# EAGLE design teensyMotors (EAGLE 9.1.3)
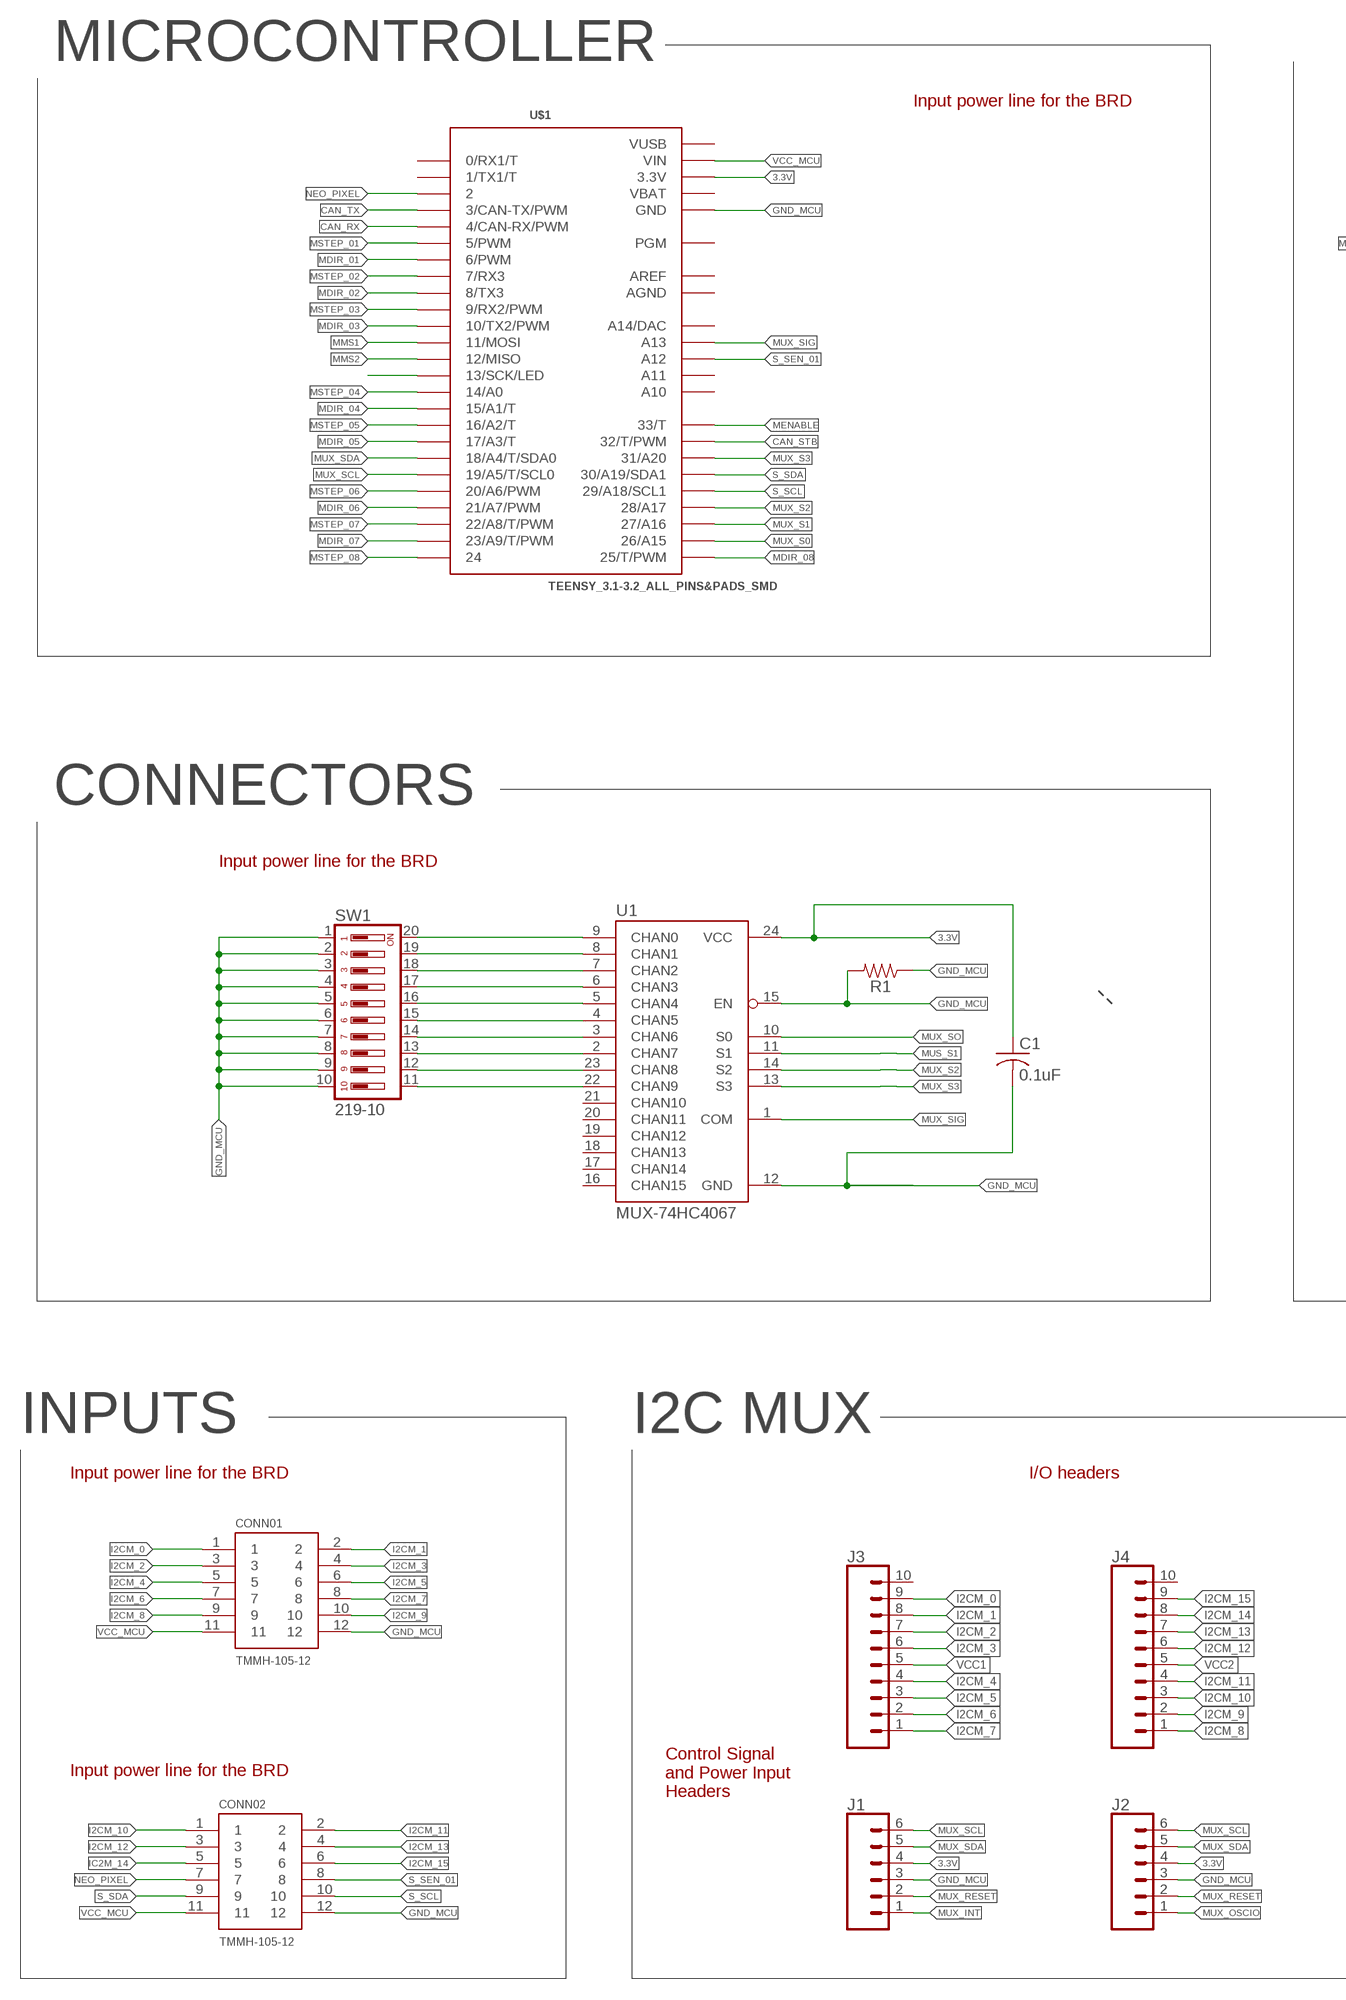
[diagram p0: schematic, sheet 1, part 1 of 2]
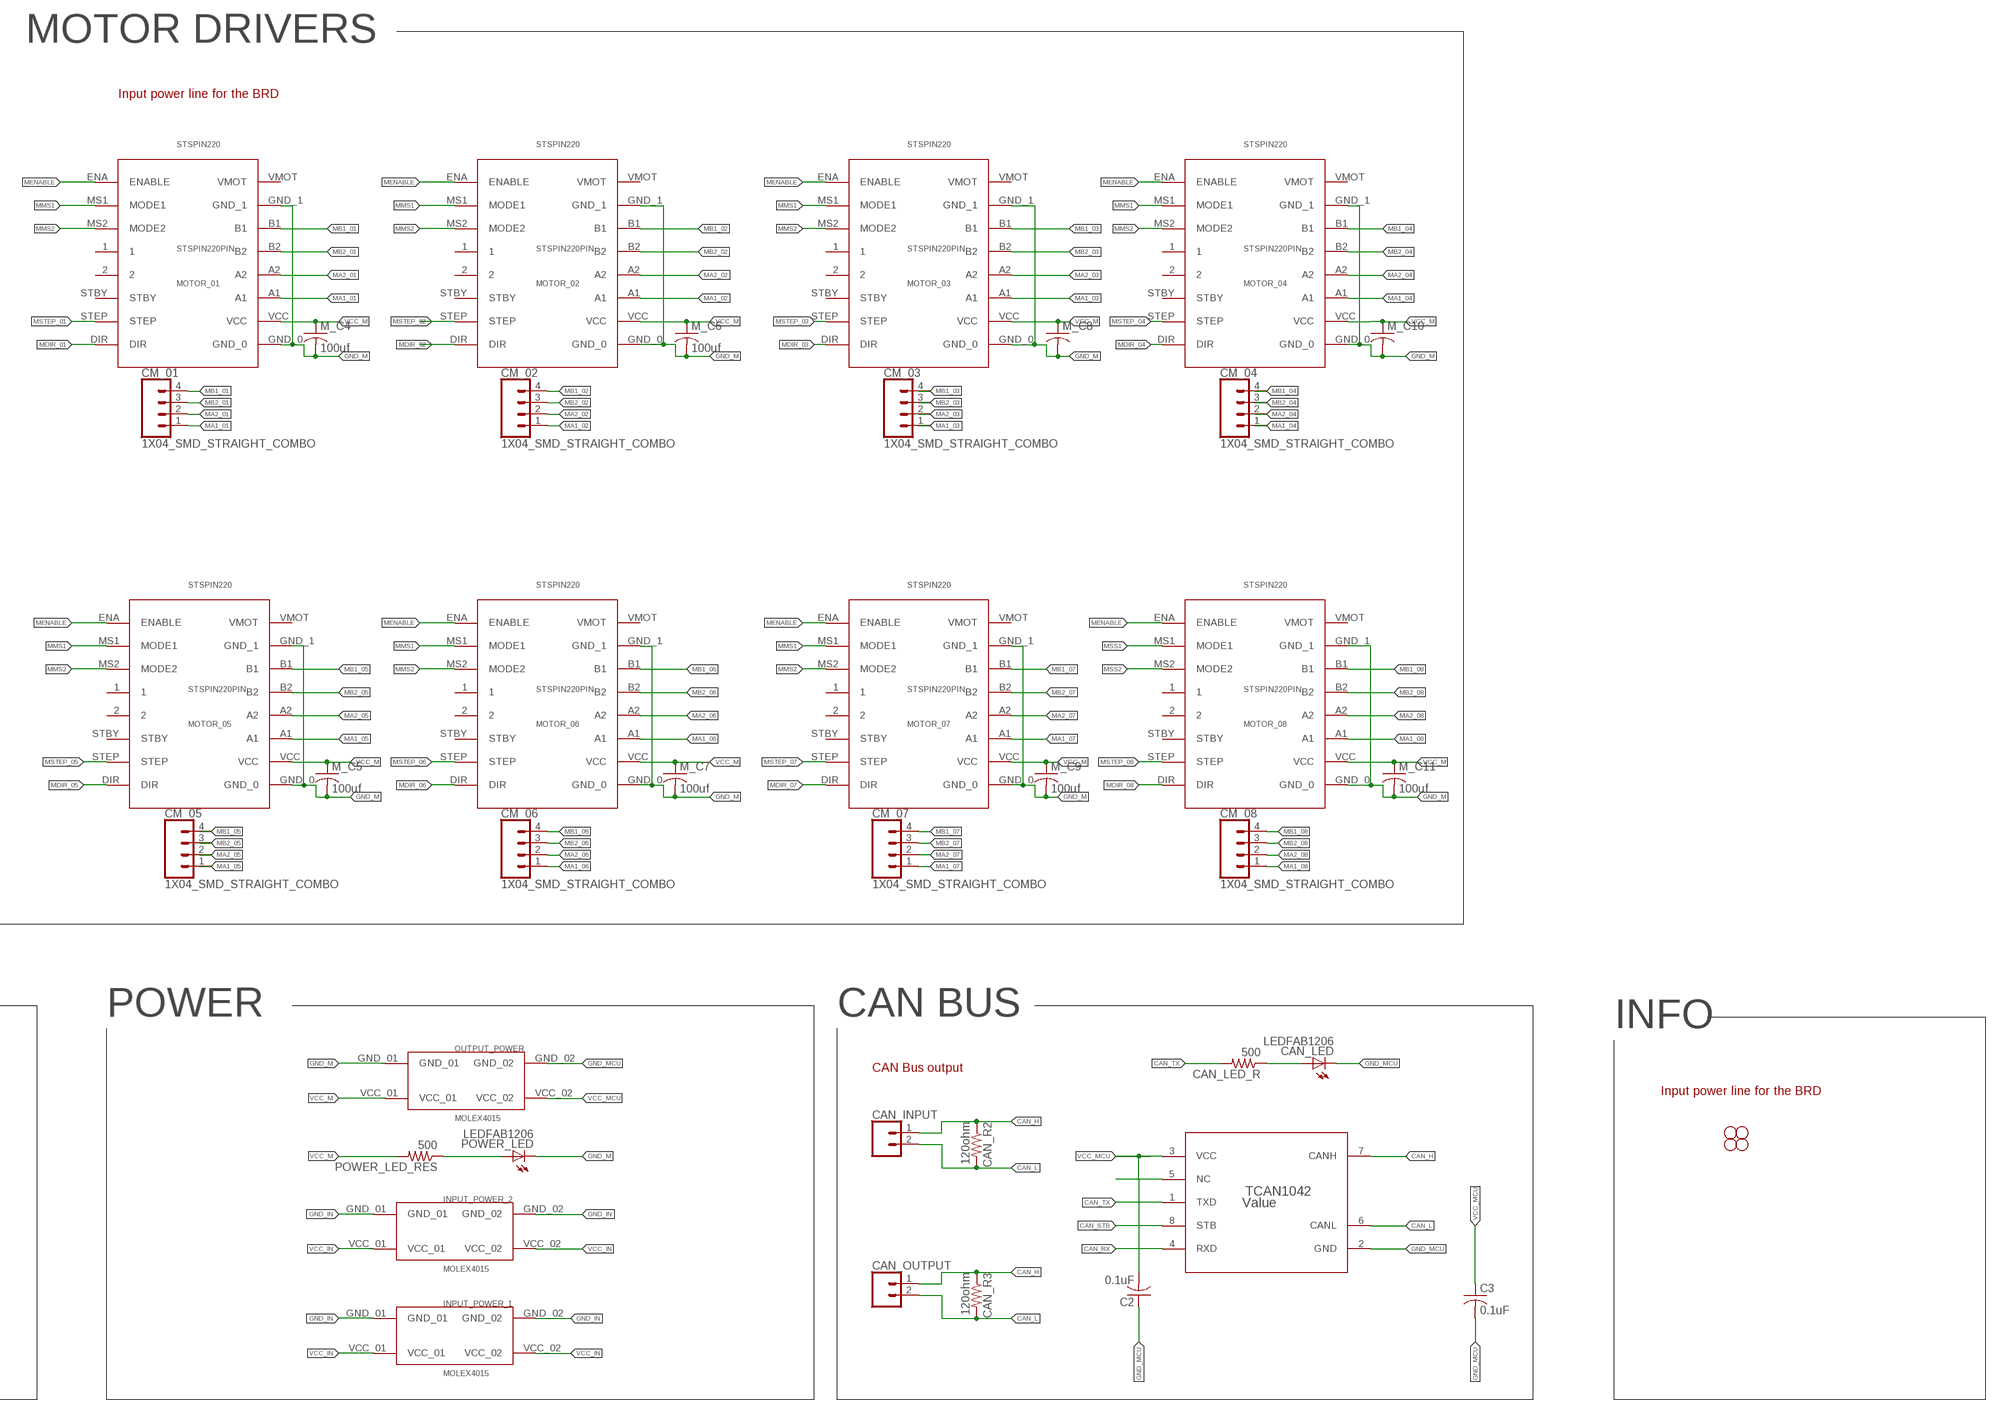
[diagram p1: schematic, sheet 1, part 2 of 2]

## Parts
C1  0.1uF  C-USC1206  [C1206]
C2  0.1uF  C-USC1206  [C1206]
C3  0.1uF  C-USC1206  [C1206]
CAN_INPUT  CONN_02-JST-2MM-SMT  [JST-2-SMD]
CAN_LED  LEDFAB1206  [LED1206FAB]
CAN_LED_R  500  RES-US1206FAB  [R1206FAB]
CAN_OUTPUT  CONN_02-JST-2MM-SMT  [JST-2-SMD]
CAN_R2  120ohm  RESISTOR1206  [1206]
CAN_R3  120ohm  RESISTOR1206  [1206]
CM_01  1X04_SMD_STRAIGHT_COMBO  CONN_04SMD_STRAIGHT_COMBO  [1X04_SMD_VERTICAL_COMBO]
CM_02  1X04_SMD_STRAIGHT_COMBO  CONN_04SMD_STRAIGHT_COMBO  [1X04_SMD_VERTICAL_COMBO]
CM_03  1X04_SMD_STRAIGHT_COMBO  CONN_04SMD_STRAIGHT_COMBO  [1X04_SMD_VERTICAL_COMBO]
CM_04  1X04_SMD_STRAIGHT_COMBO  CONN_04SMD_STRAIGHT_COMBO  [1X04_SMD_VERTICAL_COMBO]
CM_05  1X04_SMD_STRAIGHT_COMBO  CONN_04SMD_STRAIGHT_COMBO  [1X04_SMD_VERTICAL_COMBO]
CM_06  1X04_SMD_STRAIGHT_COMBO  CONN_04SMD_STRAIGHT_COMBO  [1X04_SMD_VERTICAL_COMBO]
CM_07  1X04_SMD_STRAIGHT_COMBO  CONN_04SMD_STRAIGHT_COMBO  [1X04_SMD_VERTICAL_COMBO]
CM_08  1X04_SMD_STRAIGHT_COMBO  CONN_04SMD_STRAIGHT_COMBO  [1X04_SMD_VERTICAL_COMBO]
CONN01  TMMH-105-12  [TMMH-105-12]
CONN02  TMMH-105-12  [TMMH-105-12]
INPUT_POWER_1  MOLEX4015  [MOLEX4015]
INPUT_POWER_2  MOLEX4015  [MOLEX4015]
J1  CONN_06SMD_MALE  [1X06_SMD_MALE]
J2  CONN_06SMD_MALE  [1X06_SMD_MALE]
J3  CONN_10SMD_MALE  [1X10_SMD_MALE]
J4  CONN_10SMD_MALE  [1X10_SMD_MALE]
M_C4  100uf  C-USC1206  [C1206]
M_C5  100uf  C-USC1206  [C1206]
M_C6  100uf  C-USC1206  [C1206]
M_C7  100uf  C-USC1206  [C1206]
M_C8  C-USC1206  [C1206]
M_C9  100uf  C-USC1206  [C1206]
M_C10  C-USC1206  [C1206]
M_C11  100uf  C-USC1206  [C1206]
MOTOR_01  STSPIN220PIN  [STSPIN220]
MOTOR_02  STSPIN220PIN  [STSPIN220]
MOTOR_03  STSPIN220PIN  [STSPIN220]
MOTOR_04  STSPIN220PIN  [STSPIN220]
MOTOR_05  STSPIN220PIN  [STSPIN220]
MOTOR_06  STSPIN220PIN  [STSPIN220]
MOTOR_07  STSPIN220PIN  [STSPIN220]
MOTOR_08  STSPIN220PIN  [STSPIN220]
OUTPUT_POWER  MOLEX4015  [MOLEX4015]
POWER_LED  LEDFAB1206  [LED1206FAB]
POWER_LED_RES  500  RES-US1206FAB  [R1206FAB]
R1  RESISTOR1206  [1206]
STANDOFF5  STAND-OFF  [STAND-OFF]
STANDOFF6  STAND-OFF  [STAND-OFF]
STANDOFF7  STAND-OFF  [STAND-OFF]
STANDOFF8  STAND-OFF  [STAND-OFF]
SW1  219-10  [CTS-219-10]
TCAN1042  Value  TCAN1042DRQ1  [D0008A_N]
U1  MUX-74HC4067  MUX-74HC4067SMD  [SSOP24]
U$1  TEENSY_3.1-3.2_ALL_PINS&PADS_SMD  [TEENSY_3.0-3.2_ALL_PINS_&_PADS_SMD]

## Nets
3.3V: C1.1 J1.4 J2.4 U1.24(VCC) U$1.3.3V U$1.3.3V1(3.3V) U$1.3.3V2(3.3V)
C0: SW1.20 U1.9(CHAN0)
C1: SW1.19 U1.8(CHAN1)
C2: SW1.18 U1.7(CHAN2)
C3: SW1.17 U1.6(CHAN3)
C4: SW1.16 U1.5(CHAN4)
C5: SW1.15 U1.4(CHAN5)
C6: SW1.14 U1.3(CHAN6)
C7: SW1.13 U1.2(CHAN7)
C8: SW1.12 U1.23(CHAN8)
C9: SW1.11 U1.22(CHAN9)
CAN_H: CAN_INPUT.1 CAN_OUTPUT.1 CAN_R2.1 CAN_R3.1 TCAN1042.7(CANH)
CAN_L: CAN_INPUT.2 CAN_OUTPUT.2 CAN_R2.2 CAN_R3.2 TCAN1042.6(CANL)
CAN_RX: TCAN1042.4(RXD) U$1.4(4/CAN-RX/PWM)
CAN_STB: TCAN1042.8(STB) U$1.32(32/T/PWM)
CAN_TX: CAN_LED_R.2 TCAN1042.1(TXD) U$1.3(3/CAN-TX/PWM)
GND_IN: INPUT_POWER_1.GND_01 INPUT_POWER_1.GND_02 INPUT_POWER_2.GND_01 INPUT_POWER_2.GND_02
GND_M: M_C4.2 M_C5.2 M_C6.2 M_C7.2 M_C8.2 M_C9.2 M_C10.2 M_C11.2 MOTOR_01.GND_0 MOTOR_01.GND_1 MOTOR_02.GND_0 MOTOR_02.GND_1 MOTOR_03.GND_0 MOTOR_03.GND_1 MOTOR_04.GND_0 MOTOR_04.GND_1 MOTOR_05.GND_0 MOTOR_05.GND_1 MOTOR_06.GND_0 MOTOR_06.GND_1 MOTOR_07.GND_0 MOTOR_07.GND_1 MOTOR_08.GND_0 MOTOR_08.GND_1 OUTPUT_POWER.GND_01 POWER_LED.2(C)
GND_MCU: C1.2 C2.1 C3.2 CAN_LED.2(C) CONN01.12 CONN02.12 J1.3 J2.3 OUTPUT_POWER.GND_02 R1.1 R1.2 SW1.1 SW1.2 SW1.3 SW1.4 SW1.5 SW1.6 SW1.7 SW1.8 SW1.9 SW1.10 TCAN1042.2(GND) U1.12(GND) U1.15(EN) U$1.GND U$1.GND1(GND) U$1.GND2(GND)
I2CM_0: CONN01.1 J3.9
I2CM_1: CONN01.2 J3.8
I2CM_2: CONN01.3 J3.7
I2CM_3: CONN01.4 J3.6
I2CM_4: CONN01.5 J3.4
I2CM_5: CONN01.6 J3.3
I2CM_6: CONN01.7 J3.2
I2CM_7: CONN01.8 J3.1
I2CM_8: CONN01.9 J4.1
I2CM_9: CONN01.10 J4.2
I2CM_10: CONN02.1 J4.3
I2CM_11: CONN02.2 J4.4
I2CM_12: CONN02.3 J4.6
I2CM_13: CONN02.4 J4.7
I2CM_14: J4.8
I2CM_15: CONN02.6 J4.9
IC2M_14: CONN02.5
MA1_01: CM_01.1 MOTOR_01.A1
MA1_02: CM_02.1 MOTOR_02.A1
MA1_03: CM_03.1 MOTOR_03.A1
MA1_04: CM_04.1 MOTOR_04.A1
MA1_05: CM_05.1 MOTOR_05.A1
MA1_06: CM_06.1 MOTOR_06.A1
MA1_07: CM_07.1 MOTOR_07.A1
MA1_08: CM_08.1 MOTOR_08.A1
MA2_01: CM_01.2 MOTOR_01.A2
MA2_02: CM_02.2 MOTOR_02.A2
MA2_03: CM_03.2 MOTOR_03.A2
MA2_04: CM_04.2 MOTOR_04.A2
MA2_05: CM_05.2 MOTOR_05.A2
MA2_06: CM_06.2 MOTOR_06.A2
MA2_07: CM_07.2 MOTOR_07.A2
MA2_08: CM_08.2 MOTOR_08.A2
MB1_01: CM_01.4 MOTOR_01.B1
MB1_02: CM_02.4 MOTOR_02.B1
MB1_03: CM_03.4 MOTOR_03.B1
MB1_04: CM_04.4 MOTOR_04.B1
MB1_05: CM_05.4 MOTOR_05.B1
MB1_06: CM_06.4 MOTOR_06.B1
MB1_07: CM_07.4 MOTOR_07.B1
MB1_08: CM_08.4 MOTOR_08.B1
MB2_01: CM_01.3 MOTOR_01.B2
MB2_02: CM_02.3 MOTOR_02.B2
MB2_03: CM_03.3 MOTOR_03.B2
MB2_04: CM_04.3 MOTOR_04.B2
MB2_05: CM_05.3 MOTOR_05.B2
MB2_06: CM_06.3 MOTOR_06.B2
MB2_07: CM_07.3 MOTOR_07.B2
MB2_08: CM_08.3 MOTOR_08.B2
MDIR_01: MOTOR_01.DIR U$1.6(6/PWM)
MDIR_02: MOTOR_02.DIR U$1.8(8/TX3)
MDIR_03: MOTOR_03.DIR U$1.10(10/TX2/PWM)
MDIR_04: MOTOR_04.DIR U$1.15/A1(15/A1/T)
MDIR_05: MOTOR_05.DIR U$1.17/A3(17/A3/T)
MDIR_06: MOTOR_06.DIR U$1.21/A7(21/A7/PWM)
MDIR_07: MOTOR_07.DIR U$1.23/A9(23/A9/T/PWM)
MDIR_08: MOTOR_08.DIR U$1.25(25/T/PWM)
MENABLE: MOTOR_01.ENA(ENABLE) MOTOR_02.ENA(ENABLE) MOTOR_03.ENA(ENABLE) MOTOR_04.ENA(ENABLE) MOTOR_05.ENA(ENABLE) MOTOR_06.ENA(ENABLE) MOTOR_07.ENA(ENABLE) MOTOR_08.ENA(ENABLE) U$1.33(33/T)
MMS1: MOTOR_01.MS1(MODE1) MOTOR_02.MS1(MODE1) MOTOR_03.MS1(MODE1) MOTOR_04.MS1(MODE1) MOTOR_05.MS1(MODE1) MOTOR_06.MS1(MODE1) MOTOR_07.MS1(MODE1) U$1.11(11/MOSI)
MMS2: MOTOR_01.MS2(MODE2) MOTOR_02.MS2(MODE2) MOTOR_03.MS2(MODE2) MOTOR_04.MS2(MODE2) MOTOR_05.MS2(MODE2) MOTOR_06.MS2(MODE2) MOTOR_07.MS2(MODE2) U$1.12(12/MISO)
MSS1: MOTOR_08.MS1(MODE1)
MSS2: MOTOR_08.MS2(MODE2)
MSTEP_01: MOTOR_01.STEP U$1.5(5/PWM)
MSTEP_02: MOTOR_02.STEP U$1.7(7/RX3)
MSTEP_03: MOTOR_03.STEP U$1.9(9/RX2/PWM)
MSTEP_04: MOTOR_04.STEP U$1.14/A0
MSTEP_05: MOTOR_05.STEP U$1.16/A2(16/A2/T)
MSTEP_06: MOTOR_06.STEP U$1.20/A6(20/A6/PWM)
MSTEP_07: MOTOR_07.STEP U$1.22/A8(22/A8/T/PWM)
MSTEP_08: MOTOR_08.STEP U$1.24
MUS_S1: U1.11(S1)
MUX_INT: J1.1
MUX_OSCIO: J2.1
MUX_RESET: J1.2 J2.2
MUX_S0: U$1.26(26/A15)
MUX_S1: U$1.27(27/A16)
MUX_S2: U1.14(S2) U$1.28(28/A17)
MUX_S3: U1.13(S3) U$1.31(31/A20)
MUX_SCL: J1.6 J2.6 U$1.19/A5(19/A5/T/SCL0)
MUX_SDA: J1.5 J2.5 U$1.18/A4(18/A4/T/SDA0)
MUX_SIG: U1.1(COM) U$1.A13
MUX_SO: U1.10(S0)
N$1: POWER_LED.1(A) POWER_LED_RES.1
N$3: TCAN1042.5(NC)
N$11: U$1.13(13/SCK/LED)
N$193: CAN_LED.1(A) CAN_LED_R.1
NEO_PIXEL: CONN02.7 U$1.2
S_SCL: CONN02.10 U$1.29(29/A18/SCL1)
S_SDA: CONN02.9 U$1.30(30/A19/SDA1)
S_SEN_01: CONN02.8 U$1.A12
VCC1: J3.5
VCC2: J4.5
VCC_IN: INPUT_POWER_1.VCC_01 INPUT_POWER_1.VCC_02 INPUT_POWER_2.VCC_01 INPUT_POWER_2.VCC_02
VCC_M: M_C4.1 M_C5.1 M_C6.1 M_C7.1 M_C8.1 M_C9.1 M_C10.1 M_C11.1 MOTOR_01.VCC MOTOR_02.VCC MOTOR_03.VCC MOTOR_04.VCC MOTOR_05.VCC MOTOR_06.VCC MOTOR_07.VCC MOTOR_08.VCC OUTPUT_POWER.VCC_01 POWER_LED_RES.2
VCC_MCU: C2.2 C3.1 CONN01.11 CONN02.11 OUTPUT_POWER.VCC_02 TCAN1042.3(VCC) U$1.VIN
Unconnected: J3.10 J4.10 MOTOR_01.1 MOTOR_01.2 MOTOR_01.STBY MOTOR_01.VMOT MOTOR_02.1 MOTOR_02.2 MOTOR_02.STBY MOTOR_02.VMOT MOTOR_03.1 MOTOR_03.2 MOTOR_03.STBY MOTOR_03.VMOT MOTOR_04.1 MOTOR_04.2 MOTOR_04.STBY MOTOR_04.VMOT MOTOR_05.1 MOTOR_05.2 MOTOR_05.STBY MOTOR_05.VMOT MOTOR_06.1 MOTOR_06.2 MOTOR_06.STBY MOTOR_06.VMOT MOTOR_07.1 MOTOR_07.2 MOTOR_07.STBY MOTOR_07.VMOT MOTOR_08.1 MOTOR_08.2 MOTOR_08.STBY MOTOR_08.VMOT U1.16(CHAN15) U1.17(CHAN14) U1.18(CHAN13) U1.19(CHAN12) U1.20(CHAN11) U1.21(CHAN10) U$1.0(0/RX1/T) U$1.1(1/TX1/T) U$1.A10 U$1.A11 U$1.PGM U$1.RESET/DAC(A14/DAC)

## Notes on the sheet
- MICROCONTROLLER | MOTOR DRIVERS
- Input power line for the BRD
- Input power line for the BRD
- CONNECTORS
- Input power line for the BRD
- INPUTS | I2C MUX | POWER | CAN BUS | INFO
- Input power line for the BRD | I/O headers
- CAN Bus output
- Input power line for the BRD
- Control Signal
  and Power Input
  Headers
- Input power line for the BRD

## Power pins joined to a net without a drawn wire
AGND: U$1.AGND
AREF: U$1.AREF
VBAT: U$1.VBAT
VUSB: U$1.VUSB

## Library data of the parts
C1-C3 M_C4-M_C11 = adafruit:C-US: CAPACITOR, American symbol
CAN_INPUT CAN_OUTPUT = SparkFun-Connectors:CONN_02: Multi connection point. Often used as Generic Header-pin footprint for 0.1 inch spaced/style header connections On any of the 0.1 inch spaced packages, you can populate with these: Break Away Headers - Straight <https://www.sparkfun.com/products/116> (PRT-00116) Break Away Male Headers - Right Angle <https://www.sparkfun.com/products/553> (PRT-00553) Female Headers <https://www.sparkfun.com/products/115> (PRT-00115) Break Away Headers - Machine Pin <https://www.sparkfun.com/products/117> (PRT-00117) Break Away Female Headers - Swiss Machine Pin <https://www.sparkfun.com/products/743> (PRT-00743) For SCREWTERMINALS and SPRING TERMINALS visit here: Screw Terimnals on SparkFun.com <https://www.sparkfun.com/search/results?term=Screw+Terminals> (5mm/3.5mm/2.54mm spacing) This device is also useful as a general connection point to wire up your design to another part of your project. Our various solder wires solder well into these plated through hole pads. Hook-Up Wire - Assortment (Stranded, 22 AWG) <https://www.sparkfun.com/products/11375> (PRT-11375) Hook-Up Wire - Assortment (Solid Core, 22 AWG) <https://www.sparkfun.com/products/11367> (PRT-11367) View the entire wire category on our website here <https://www.sparkfun.com/categories/141> Special notes: Molex polarized connector foot print use with: PRT-08233 with associated crimp pins and housings. 2.54_SCREWTERM for use with PRT-10571. 3.5mm Screw Terminal footprints for PRT-08084 5mm Screw Terminal footprints for use with PRT-08432; PROD_ID: CONN-11443
CAN_LED POWER_LED = fab:LED: LED
CAN_LED_R POWER_LED_RES = fab:RES-US: Resistor (US Symbol) Variants with postfix FAB are widened to allow the routing of internal traces
CAN_R2 CAN_R3 R1 = SparkFun-Resistors:RESISTOR: Generic Resistor Package
CM_01-CM_08 = SparkFun-Connectors:CONN_04: Multi connection point. Often used as Generic Header-pin footprint for 0.1 inch spaced/style header connections On any of the 0.1 inch spaced packages, you can populate with these: Break Away Headers - Straight <https://www.sparkfun.com/products/116> (PRT-00116) Break Away Male Headers - Right Angle <https://www.sparkfun.com/products/553> (PRT-00553) Female Headers <https://www.sparkfun.com/products/115> (PRT-00115) Break Away Headers - Machine Pin <https://www.sparkfun.com/products/117> (PRT-00117) Break Away Female Headers - Swiss Machine Pin <https://www.sparkfun.com/products/743> (PRT-00743) For SCREWTERMINALS and SPRING TERMINALS visit here: Screw Terimnals on SparkFun.com <https://www.sparkfun.com/search/results?term=Screw+Terminals> (5mm/3.5mm/2.54mm spacing) This device is also useful as a general connection point to wire up your design to another part of your project. Our various solder wires solder well into these plated through hole pads. Hook-Up Wire - Assortment (Stranded, 22 AWG) <https://www.sparkfun.com/products/11375> (PRT-11375) Hook-Up Wire - Assortment (Solid Core, 22 AWG) <https://www.sparkfun.com/products/11367> (PRT-11367) View the entire wire category on our website here <https://www.sparkfun.com/categories/141> Special notes: Molex polarized connector foot print use with SKU : PRT-08231 with associated crimp pins and housings. 1MM SMD Version SKU: PRT-10208; PROD_ID: CONN-08511
CONN01 CONN02 = TMMH-105-XX-XX-DV:TMMH-105-12: 2mm (.0787") Flex Shroud, .020" (.51mm) Square Post Terminal Strip, Surface Mount,10 Pins.
INPUT_POWER_1 INPUT_POWER_2 OUTPUT_POWER = MOLEX4015:MOLEX4015
J1 J2 = SparkFun-Connectors:CONN_06: Multi connection point. Often used as Generic Header-pin footprint for 0.1 inch spaced/style header connections On any of the 0.1 inch spaced packages, you can populate with these: Break Away Headers - Straight <https://www.sparkfun.com/products/116> (PRT-00116) Break Away Male Headers - Right Angle <https://www.sparkfun.com/products/553> (PRT-00553) Female Headers <https://www.sparkfun.com/products/115> (PRT-00115) Break Away Headers - Machine Pin <https://www.sparkfun.com/products/117> (PRT-00117) Break Away Female Headers - Swiss Machine Pin <https://www.sparkfun.com/products/743> (PRT-00743) Arduino Stackable Header - 6 Pin <https://www.sparkfun.com/products/9280> (PRT-09280) For SCREWTERMINALS and SPRING TERMINALS visit here: Screw Terimnals on SparkFun.com <https://www.sparkfun.com/search/results?term=Screw+Terminals> (5mm/3.5mm/2.54mm spacing) This device is also useful as a general connection point to wire up your design to another part of your project. Our various solder wires solder well into these plated through hole pads. Hook-Up Wire - Assortment (Stranded, 22 AWG) <https://www.sparkfun.com/products/11375> (PRT-11375) Hook-Up Wire - Assortment (Solid Core, 22 AWG) <https://www.sparkfun.com/products/11367> (PRT-11367) View the entire wire category on our website here <https://www.sparkfun.com/categories/141>; PROD_ID: CONN-11293
J3 J4 = SparkFun-Connectors:CONN_10: Multi connection point. Often used as Generic Header-pin footprint for 0.1 inch spaced/style header connections On any of the 0.1 inch spaced packages, you can populate with these: Break Away Headers - Straight <https://www.sparkfun.com/products/116> (PRT-00116) Break Away Male Headers - Right Angle <https://www.sparkfun.com/products/553> (PRT-00553) Female Headers <https://www.sparkfun.com/products/115> (PRT-00115) Break Away Headers - Machine Pin <https://www.sparkfun.com/products/117> (PRT-00117) Break Away Female Headers - Swiss Machine Pin <https://www.sparkfun.com/products/743> (PRT-00743) Arduino Stackable Header - 10 Pin <https://www.sparkfun.com/products/11376> (PRT-11376) For SCREWTERMINALS and SPRING TERMINALS visit here: Screw Terimnals on SparkFun.com <https://www.sparkfun.com/search/results?term=Screw+Terminals> (5mm/3.5mm/2.54mm spacing) This device is also useful as a general connection point to wire up your design to another part of your project. Our various solder wires solder well into these plated through hole pads. Hook-Up Wire - Assortment (Stranded, 22 AWG) <https://www.sparkfun.com/products/11375> (PRT-11375) Hook-Up Wire - Assortment (Solid Core, 22 AWG) <https://www.sparkfun.com/products/11367> (PRT-11367) View the entire wire category on our website here <https://www.sparkfun.com/categories/141> Special notes: Molex polarized connector foot print use with SKU : PRT-08231 with associated crimp pins and housings. 1MM SMD Version SKU: PRT-10208 NOTES ON THE VARIANTS LOCK and LOCK_LONGPADS... This footprint was designed to help hold the alignment of a through-hole component (i.e. 6-pin header) while soldering it into place. You may notice that each hole has been shifted either up or down by 0.005 of an inch from it's more standard position (which is a perfectly straight line). This slight alteration caused the pins (the squares in the middle) to touch the edges of the holes. Because they are alternating, it causes a "brace" to hold the component in place. 0.005 has proven to be the perfect amount of "off-center" position when using our standard breakaway headers. Although looks a little odd when you look at the bare footprint, once you have a header in there, the alteration is very hard to notice. Also,if you push a header all the way into place, it is covered up entirely on the bottom side.; PROD_ID: CONN-11291
MOTOR_01-MOTOR_08 = STSPIN220:STSPIN220
STANDOFF5-STANDOFF8 = SparkFun-Electromechanical:STAND-OFF: #4 Stand Off This is the mechanical footprint for a #4 phillips button head screw. Use the keepout ring to avoid running the screw head into surrounding components. SKU : PRT-00447
SW1 = switch-dil:219-10*: Surface Mount DIP Switch Series 219 SMT CTS Electronic Components Sourc: www.ctscorp.com; MF: SLI (CML/IDI); MPN: 219-10PK; OC_FARNELL: unknown; OC_NEWARK: 19M0224
TCAN1042 = TCAN1042DRQ1:TCAN1042DRQ1; MANUFACTURER: Texas Instruments; PARTNUMBER: TCAN1042DRQ1; REFDES: RefDes; TYPE: TYPE
U1 = SparkFun:MUX-74HC4067
U$1 = Teensy_3_and_LC_Series_Boards_v1.4:TEENSY_3.1-3.2_ALL_PINS&PADS_SMD: Footprint for Teensy 3.1 or 3.2 board using all pads and all through-holes. Pads need a 2x7 0.1" SMD header.

## Net classes
0 default: clearance 0.205 mm

## Board
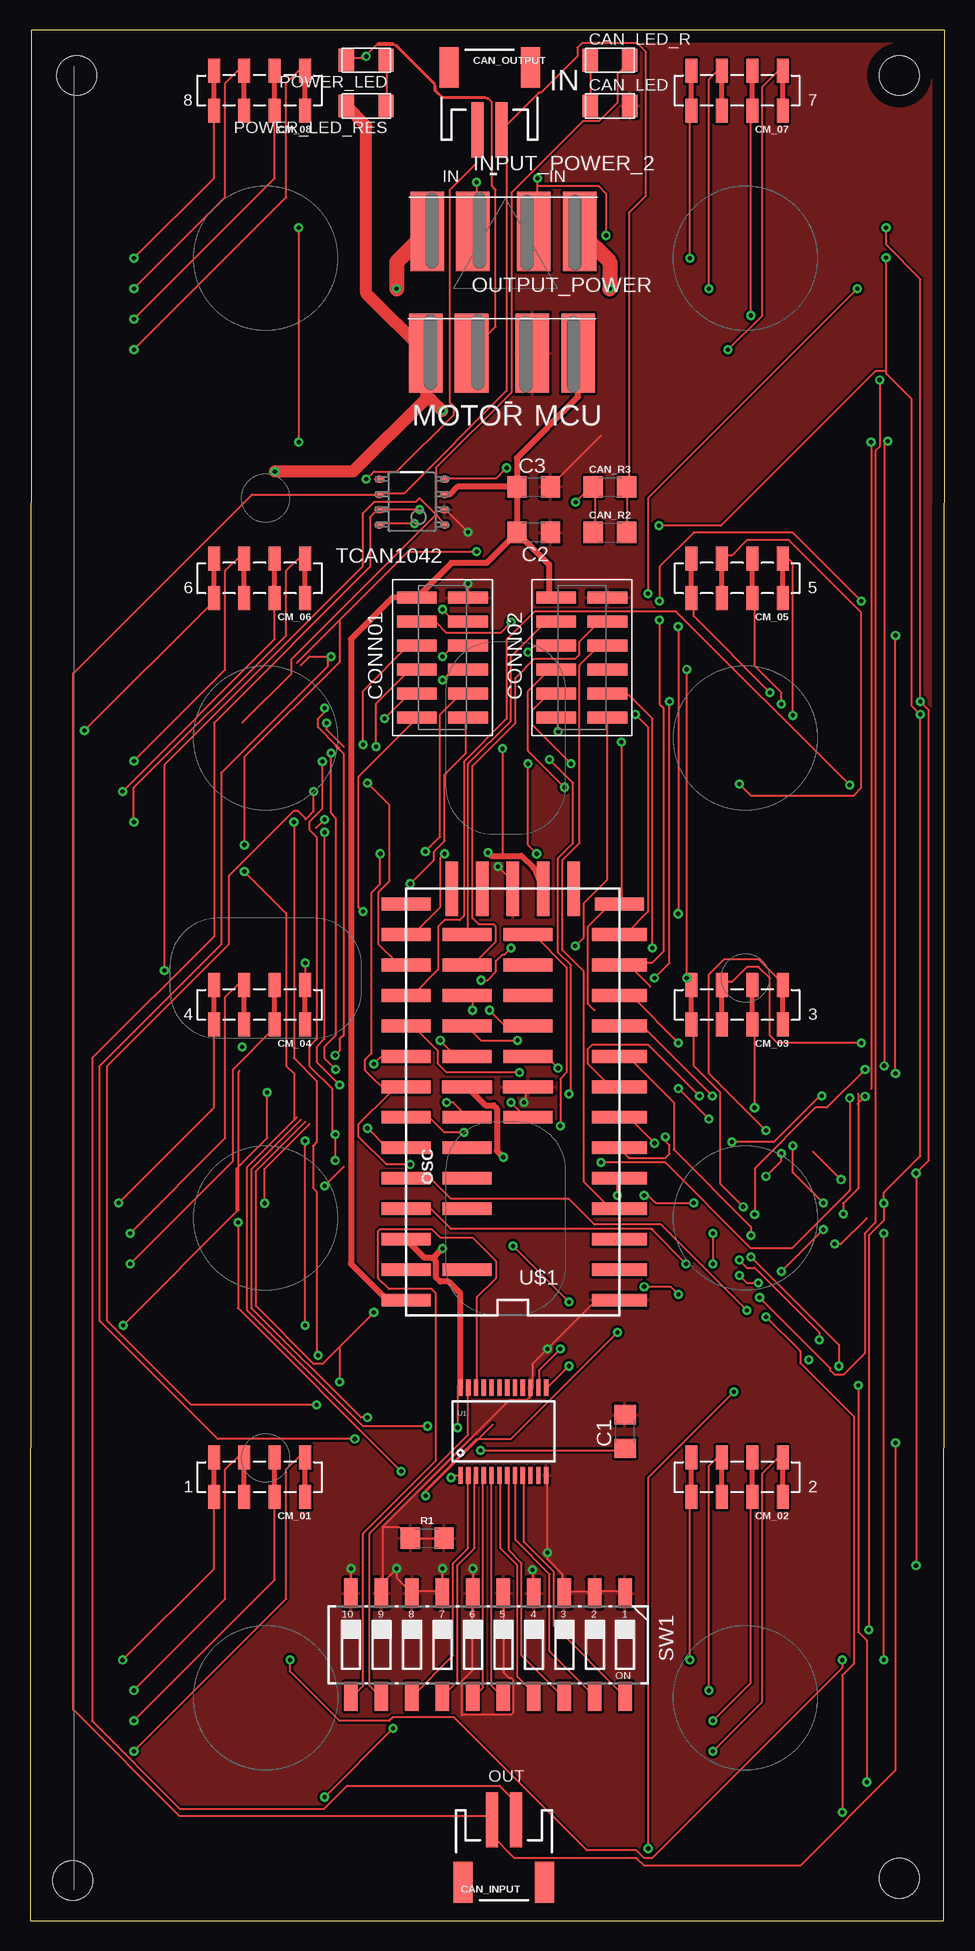
[diagram p2: board, top side]
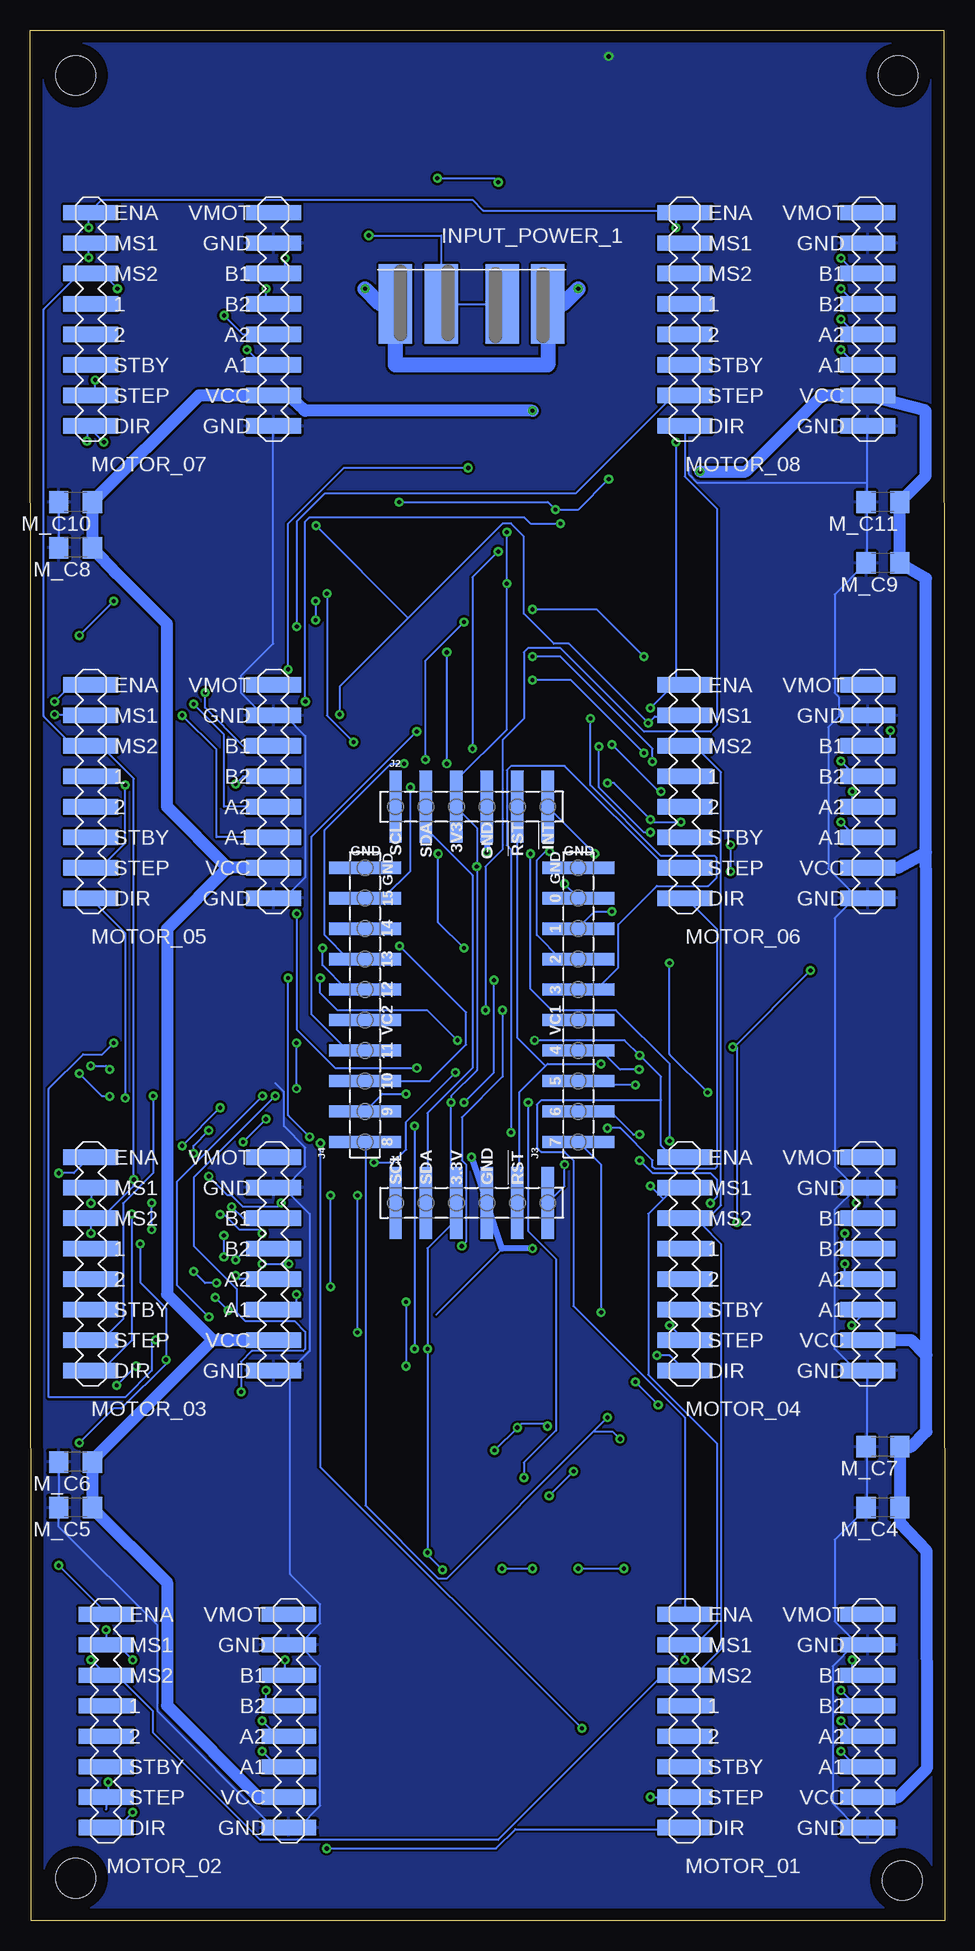
[diagram p3: board, bottom side, seen from below]

Size 76.28 x 157.61 mm. Coordinates in mm from the lower left corner, seen from the top.
Outline: 0,0 76.19,0 76.28,157.61 0.09,157.61 0,0
Copper layers (1*16): Top 0.035mm / dielectric 1.5mm / Bottom 0.035mm
Design rules "default": minimum track width 6mil, minimum drill 0.35mm, track to track 6mil, track to pad 6mil, pad to pad 6mil, via to via 6mil, smd to smd 6mil, copper to edge 40mil, drill to drill 6mil, minimum pad ring 10mil, minimum via ring 8mil, stop-mask expansion 4mil, vias tented up to drill 0mil, thermal gap 10mil

### Footprints (pad centres in the part's own frame; a part is rotated, then mirrored left to right if it is on the bottom)
C1206 = smd 1.6 x 1.8: 1 -1.4,0; 2 1.4,0
JST-2-SMD = smd 1 x 4.6: 1 -1,-3.7; 2 1,-3.7 | smd 1.6 x 3.4: NC1 -3.4,1.5; NC2 3.4,1.5
LED1206FAB = smd 1.27 x 1.905: 1 -1.651,0; 2 1.651,0
R1206FAB = smd 1.27 x 1.905: 1 -1.651,0; 2 1.651,0
1206 = smd 1.6 x 1.8: 1 -1.4,0; 2 1.4,0
1X04_SMD_VERTICAL_COMBO = smd 1 x 2: 1 0,-1.65; 1-2 0,1.65; 2 2.54,1.65; 2-2 2.54,-1.65; 3 5.08,-1.65; 3-2 5.08,1.65; 4 7.62,1.65; 4-2 7.62,-1.65
TMMH-105-12 = smd 1.016 x 3.302: 1 -5.27,-2.134; 2 -5.27,2.134; 3 -3.27,-2.134; 4 -3.27,2.134; 5 -1.27,-2.134; 6 -1.27,2.134; 7 0.73,-2.134; 8 0.73,2.134; 9 2.73,-2.134; 10 2.73,2.134; 11 4.73,2.134; 12 4.73,-2.134
MOLEX4015 = smd 2.794 x 6.604: GND_01 -2.54,3.81; GND_02 2.54,3.81; VCC_01 -6.35,3.81; VCC_02 6.35,3.81
1X06_SMD_MALE = smd 1.02 x 6: 1 0,0; 2 2.54,0; 3 5.08,0; 4 7.62,0; 5 10.16,0; 6 12.7,0
1X10_SMD_MALE = smd 1.02 x 6: 1 0,0; 2 2.54,0; 3 5.08,0; 4 7.62,0; 5 10.16,0; 6 12.7,0; 7 15.24,0; 8 17.78,0; 9 20.32,0; 10 22.86,0
STSPIN220 = smd 4.572 x 1.27: 1 -7.62,2.54; 2 -7.62,0; A1 7.62,-2.54; A2 7.62,0; B1 7.62,5.08; B2 7.62,2.54; DIR -7.62,-7.62; ENA -7.62,10.16; GND_0 7.62,-7.62; GND_1 7.62,7.62; MS1 -7.62,7.62; MS2 -7.62,5.08; STBY -7.62,-2.54; STEP -7.62,-5.08; VCC 7.62,-5.08; VMOT 7.62,10.16
STAND-OFF = hole 3.302: 0,0
CTS-219-10 = smd 1.13 x 2.44: 1 -11.43,-4.3; 2 -8.89,-4.3; 3 -6.35,-4.3; 4 -3.81,-4.3; 5 -1.27,-4.3; 6 1.27,-4.3; 7 3.81,-4.3; 8 6.35,-4.3; 9 8.89,-4.3; 10 11.43,-4.3; 11 11.43,4.3; 12 8.89,4.3; 13 6.35,4.3; 14 3.81,4.3; 15 1.27,4.3; 16 -1.27,4.3; 17 -3.81,4.3; 18 -6.35,4.3; 19 -8.89,4.3; 20 -11.43,4.3
D0008A_N = smd 0.85 x 0.6: 1 -2.725,1.905; 2 -2.725,0.635; 3 -2.725,-0.635; 4 -2.725,-1.905; 5 2.725,-1.905; 6 2.725,-0.635; 7 2.725,0.635; 8 2.725,1.905
SSOP24 = smd 0.348 x 1.397: 1 -3.575,-3.656; 2 -2.925,-3.656; 3 -2.275,-3.656; 4 -1.625,-3.656; 5 -0.975,-3.656; 6 -0.325,-3.656; 7 0.325,-3.656; 8 0.975,-3.656; 9 1.625,-3.656; 10 2.275,-3.656; 11 2.925,-3.656; 12 3.575,-3.656; 13 3.575,3.656; 14 2.925,3.656; 15 2.275,3.656; 16 1.625,3.656; 17 0.975,3.656; 18 0.325,3.656; 19 -0.325,3.656; 20 -0.975,3.656; 21 -1.625,3.656; 22 -2.275,3.656; 23 -2.925,3.656; 24 -3.575,3.656
TEENSY_3.0-3.2_ALL_PINS_&_PADS_SMD = smd 4.572 x 1.067: 0 -8.89,13.97; 1 -8.89,11.43; 2 -8.89,8.89; 3 -8.89,6.35; 4 -8.89,3.81; 5 -8.89,1.27; 6 -8.89,-1.27; 7 -8.89,-3.81; 8 -8.89,-6.35; 9 -8.89,-8.89; 10 -8.89,-11.43; 11 -8.89,-13.97; GND -8.89,16.51 | smd 4.064 x 1.067: 3.3V 8.89,11.43; 12 -8.89,-16.51; 13 8.89,-16.51; 14/A0 8.89,-13.97; 15/A1 8.89,-11.43; 16/A2 8.89,-8.89; 17/A3 8.89,-6.35; 18/A4 8.89,-3.81; 19/A5 8.89,-1.27; 20/A6 8.89,1.27; 21/A7 8.89,3.81; 22/A8 8.89,6.35; 23/A9 8.89,8.89; 24 -1.27,-3.81; 25 -1.27,-6.35; 26 -1.27,-8.89; 27 -1.27,-11.43; 28 -1.27,-13.97; 29 3.81,-13.97; 30 3.81,-11.43; 31 3.81,-8.89; 32 3.81,-6.35; 33 3.81,-3.81; A10 3.81,6.35; A11 3.81,3.81; A12 -1.27,1.27; A13 3.81,1.27; AGND 8.89,13.97; AREF 3.81,8.89; VIN 8.89,16.51; VUSB 3.81,13.97 | smd 1.067 x 4.572: 3.3V1 -2.54,-17.78; GND1 0,-17.78; PGM 2.54,-17.78; RESET/DAC 5.08,-17.78; VBAT -5.08,-17.78 | smd 4.191 x 1.067: 3.3V2 3.81,-1.27; GND2 -1.27,-1.27

### Placement (x,y rotation side)
C1  49.62,40.79 90 top
C2  42,115.72 180 top
C3  42,119.53 0 top
CAN_INPUT  39.5,4.71 180 top
CAN_LED  48.35,151.28 0 top
CAN_LED_R  48.35,155.09 0 top
CAN_OUTPUT  38.33,152.98 0 top
CAN_R2  48.35,115.72 0 top
CAN_R3  48.35,119.53 0 top
CM_01  22.95,36.98 180 top
CM_02  62.77,36.98 180 top
CM_03  62.77,76.35 180 top
CM_04  22.95,76.35 180 top
CM_05  62.77,111.91 180 top
CM_06  22.95,111.91 180 top
CM_07  62.77,152.55 180 top
CM_08  22.95,152.55 180 top
CONN01  34.38,105.56 90 top
CONN02  46.02,105.56 90 top
INPUT_POWER_1  39.46,130.96 0 bottom
INPUT_POWER_2  39.47,137 0 top
J1  45.81,59.84 0 bottom
J2  45.81,92.86 0 bottom
J3  30.57,64.92 90 bottom
J4  48.35,64.92 90 bottom
M_C4  5.17,34.44 180 bottom
M_C5  72.48,34.44 180 bottom
M_C6  72.48,38.25 180 bottom
M_C7  5.17,39.52 180 bottom
M_C8  72.48,114.45 180 bottom
M_C9  5.17,113.18 180 bottom
M_C10  72.48,118.26 180 bottom
M_C11  5.17,118.26 180 bottom
MOTOR_01  14.06,15.39 0 bottom
MOTOR_02  62.32,15.39 0 bottom
MOTOR_03  63.59,53.49 0 bottom
MOTOR_04  14.06,53.49 0 bottom
MOTOR_05  63.59,92.86 0 bottom
MOTOR_06  14.06,92.86 0 bottom
MOTOR_07  63.59,132.23 0 bottom
MOTOR_08  14.06,132.23 0 bottom
OUTPUT_POWER  39.35,126.85 0 top
POWER_LED  28.03,155.09 180 top
POWER_LED_RES  28.03,151.28 180 top
R1  33.11,31.9 0 top
STANDOFF5  72.48,3.53 0 top
STANDOFF6  3.57,3.36 0 top
STANDOFF7  72.48,153.82 0 top
STANDOFF8  3.9,153.82 0 top
SW1  38.19,23.01 180 top
TCAN1042  31.84,118.26 180 top
U1  39.46,40.79 0 top
U$1  40.25,68.24 180 top

### Tracks (layer width: path | path; a pad name or v marks a point on that pad's centre or on a via)
3.3V  (via drill 0.35)
  Top 0.152: v39.39,97.7 39.39,88.77 | v37.24,114.14 31.53,114.14 25.81,108.42 | 22.23,104.85 25.81,108.42 | 22.05,66.78 18.12,62.85 18.12,50.88 27.77,41.23 v33.13,41.23 | 22.05,66.78 22.23,66.96 | v37.56,39.2 49.62,39.2 C1.1 | v35.65,41.1 35.65,44.6 35.89,44.6 | v17.87,87.46 21.37,83.97 21.37,71.27 22,70.63 22,66.82 22.05,66.78 | v17.87,89.68 17.87,96.98 25.81,104.92 25.81,108.41 25.81,108.42
  Top 0.508: U1.24 35.89,44.6 35.89,52.29 34.89,53.28 34.22,53.28 33.85,53.65 33.85,55 33.58,55.27 | 33.58,55.27 32.91,55.27 U$1.3.3V | 33.58,55.27 33.62,55.27 v34.38,56.03 | v38.19,89.05 38.47,88.77 39.39,88.77 40.97,88.77 41.97,87.78 42,87.78 U$1.3.3V1 | U$1.3.3V2 37.99,67.97 38.66,67.97 38.93,67.7 38.93,64.18 v39.46,63.65
  Bottom 0.152: 42.43,50.52 37.07,55.88 36.92,56.03 | v39.39,97.7 39.39,111.99 v37.24,114.14 | v37.56,39.2 v35.65,41.1 35.34,41.42 33.43,41.42 v33.13,41.23 | v17.87,89.68 v17.87,87.46
  Bottom 0.508: v34.38,56.03 36.92,56.03 J1.4 v39.46,63.65 | J2.4 v38.19,89.05
C0
  Top 0.152: U1.9 41.18,37.12 41.18,31.58 43.68,29.08 43.68,24.61 49.57,18.71 SW1.20
C1
  Top 0.152: U1.8 40.46,37.12 40.46,31.76 43.32,28.9 43.32,22.46 SW1.19
C2
  Top 0.152: U1.7 39.92,37.12 39.92,30.88 41,29.81 41,22.11 44.39,18.71 SW1.18
C3
  Top 0.152: U1.6 39.21,37.12 39.21,31.06 40.64,29.63 40.64,20.32 41.89,19.07 41.89,18.71 SW1.17
C4
  Top 0.152: U1.5 38.49,19.61 39.39,18.71 SW1.16
C5
  Top 0.152: U1.4 37.78,37.12 37.78,19.43 37.07,18.71 SW1.15
C6
  Top 0.152: U1.3 37.07,37.12 37.07,31.06 35.64,29.63 35.64,19.96 SW1.14
C7
  Top 0.152: U1.2 36.53,37.12 36.53,31.06 35.28,29.81 35.28,22.11 31.88,18.71 SW1.13
C8
  Top 0.152: U1.23 36.53,44.27 36.53,40.51 28.31,32.29 28.31,19.61 29.2,18.71 SW1.12
C9
  Top 0.152: U1.22 37.24,44.45 37.24,51.95 38.85,53.56 38.85,54.99 36.89,56.96 34.21,56.96 33.49,57.67 29.2,57.67 29.02,57.49 29.02,53.56 29.92,52.67 33.49,52.67 33.85,52.31 33.85,38.37 27.77,32.29 27.77,19.61 26.88,18.71 SW1.11
CAN_H  (via drill 0.35)
  Top 0.152: v32.48,117.62 TCAN1042.7 28.99,117.62 28.35,116.99 28.35,112.86 15.33,99.84 15.33,82.06 5.17,71.9 5.17,16.66 12.48,9.35 24.54,9.35 26.45,11.26 39.15,11.26 40.42,9.99 40.42,8.72 CAN_INPUT.1 | v45.5,118.26 46.77,119.53 CAN_R3.1 47.08,119.53 47.08,115.72 CAN_R2.1 | v28.03,120.16 28.67,120.8 30.57,120.8 35.34,125.56 35.34,126.19 35.02,126.51 35.02,144.29 37.24,146.51 37.24,149.06 CAN_OUTPUT.1
  Bottom 0.152: v45.5,118.26 33.11,118.26 v32.48,117.62 30.57,117.62 v28.03,120.16
CAN_L  (via drill 0.35)
  Top 0.152: 69.77,58.56 67.62,56.42 v67.09,56.42 | CAN_INPUT.2 38.67,8.37 38.67,6.56 CAN_INPUT.2 | 49.93,115.57 CAN_R2.2 49.75,115.75 49.75,119.5 CAN_R3.2 49.93,119.68 49.93,142.37 51.36,143.8 51.36,155.78 50.65,156.49 46,156.49 45.64,156.13 45.64,155.42 42.61,152.38 42.43,152.38 39.39,149.34 CAN_OUTPUT.2 39.39,149.16 39.75,148.81 39.75,127.54 31.17,118.96 29.2,118.96 TCAN1042.6 18.51,118.89 3.59,103.97 3.59,17.61 12.48,8.72 38.19,8.72 CAN_INPUT.2 | v72.17,39.84 72.17,12.53 64.23,4.59 51.21,4.59 50.58,5.23 40.42,5.23 38.51,7.13 38.51,7.77 CAN_INPUT.2
  Bottom 0.152: v67.09,56.42 67.09,53.2 64.94,51.06 v64.94,46.77 64.86,46.5 68.67,42.69 69.31,42.69 v72.17,39.84
CAN_RX  (via drill 0.35)
  Top 0.152: v39.75,121.11 38.85,120.21 34.74,120.21 TCAN1042.4 | v54.76,78.58 v54.76,104.31 | v52.97,65.35 52.97,65 53.33,64.64 53.33,63.92 52.97,63.57 49.93,63.57 49.22,64.28 U$1.4
  Bottom 0.152: v39.75,121.11 50.11,121.11 54.76,116.46 v54.76,104.31 | v54.76,78.58 54.76,67.14 v52.97,65.35
CAN_STB  (via drill 0.35)
  Top 0.152: v32.06,116.46 29.2,116.46 TCAN1042.8 | v53.33,101.63 53.33,79.83 v52.08,78.58 | v40.64,73.39 37.6,73.39 36.53,74.47 U$1.32
  Bottom 0.152: v32.06,116.46 34.56,116.46 35.1,117 52.97,117 53.33,116.64 v53.33,101.63 | v52.08,78.58 52.08,77.33 50.65,75.9 43.14,75.9 v40.64,73.39
CAN_TX  (via drill 0.35)
  Top 0.152: 33.84,117.2 34.06,116.98 | 34.06,116.98 34.52,116.52 TCAN1042.1 | 33.84,117.2 33.84,121.11 40.13,127.4 40.13,144.06 46.08,150.01 47.44,150.01 48.97,151.54 48.97,153.92 49.99,154.94 CAN_LED_R.2 | 49.99,61.78 49.14,61.78 U$1.3 48.99,61.74 v48.99,60.47 | 38.6,41.38 32.99,35.77 v32.99,35.43 32.8,35.71 37.24,40.15 40.1,40.15 v48.99,49.04 | v30.95,37.47 17.35,51.07 v17.35,58.21 | 17.69,99.86 21.77,103.94 21.77,105.13 33.84,117.2 | v11.21,79.2 11.21,96.35 27.72,112.86 27.72,117.3 28.67,118.26 32.16,118.26 32.48,118.57 34.07,116.99 34.06,116.98
  Bottom 0.152: v30.95,37.47 v32.99,35.43 | v17.35,58.21 17.35,72.83 v17.69,72.83 17.56,72.85 v11.21,79.2 | v48.99,49.04 v48.99,60.47
GND_IN  (via drill 0.35)
  Top 0.152: v37.24,144.93 37.24,141.12 INPUT_POWER_2.GND_01 | 42.32,144.61 42.32,141.12 INPUT_POWER_2.GND_02 | 42.32,144.61 v42.32,145.25 | v48.04,140.48 48.04,143.97 47.4,144.61 42.32,144.61
  Bottom 0.152: INPUT_POWER_1.GND_02 INPUT_POWER_1.GND_01 42,140.48 v48.04,140.48 | v37.24,144.93 37.56,145.25 v42.32,145.25
GND_M  (via drill 0.35)
  Top 0.152: 28.94,156.41 29.02,156.49 30.28,156.49 33.85,152.92 33.85,152.56 34.38,152.02 37.96,152.02 38.14,151.84 | 28.94,156.41 27.99,155.45 | 27.99,155.45 27.77,155.24 26.52,155.24 POWER_LED.2 | 36.89,130.76 OUTPUT_POWER.GND_01 36.92,130.96 38.83,132.86 38.83,144.29 38.51,144.61 38.51,151.59 38.19,151.91 34.38,151.91 33.75,152.55 33.75,153.18 30.57,156.36 28.99,156.36 28.94,156.41 | v28.03,155.41 27.99,155.45
  Bottom 0.152: 54.58,45.88 55.83,45.88 MOTOR_03.GND_0 54.58,45.88 | 54.58,45.88 52.97,47.48 52.97,58.92 55.11,61.07 | 55.11,61.07 55.83,61.07 MOTOR_03.GND_1 55.11,61.07 | M_C6.2 73.88,38.19 M_C5.2 73.88,34.26 73.88,32.83 65.66,24.61 65.66,17.46 56.01,7.81 54.76,7.81 MOTOR_02.GND_0 54.58,7.81 53.86,7.81 52.08,9.6 52.08,21.21 53.86,23 | 53.86,23 54.58,23 MOTOR_02.GND_1 53.86,23 | 54.58,45.88 54.58,28.9 52.08,26.4 52.08,24.79 53.86,23 | 55.83,69.82 55.11,69.11 55.11,66.25 53.33,64.46 53.33,62.85 55.11,61.07 | 55.83,85.19 MOTOR_05.GND_0 55.83,85.37 54.94,85.37 53.33,86.98 53.33,98.77 54.94,100.38 55.83,100.38 MOTOR_05.GND_1 56.01,100.56 56.9,100.56 58.69,102.34 58.69,103.77 56.01,106.45 56.01,124.5 MOTOR_07.GND_0 55.83,124.68 | M_C8.2 73.88,114.5 M_C10.2 73.88,118.43 | 57.26,139.69 56.01,139.69 MOTOR_07.GND_1 55.83,139.87 55.11,139.87 | 7.58,23 9.37,21.21 9.37,9.78 7.4,7.81 6.51,7.81 MOTOR_01.GND_0 | 7.58,23 6.51,23 MOTOR_01.GND_1 7.58,23 | 7.4,61.07 6.51,61.07 MOTOR_04.GND_1 7.4,61.07 | 7.4,61.07 9.19,59.28 9.19,47.66 7.4,45.88 6.51,45.88 MOTOR_04.GND_0 6.51,45.7 6.51,39.62 M_C7.2 6.51,39.44 6.51,34.44 M_C4.2 6.69,34.26 9.19,31.76 9.19,24.97 7.58,23.36 7.58,23 | 7.4,85.37 6.51,85.37 MOTOR_06.GND_0 7.4,85.37 | 7.4,85.37 9.72,87.69 9.72,99.48 8.83,100.38 | 8.83,100.38 6.51,100.38 MOTOR_06.GND_1 | 6.51,119.86 6.51,124.5 MOTOR_08.GND_0 | 6.51,119.86 6.51,118.43 M_C11.2 6.51,118.25 6.51,113.24 M_C9.2 6.69,113.07 9.19,110.56 9.19,102.34 8.83,101.99 8.83,100.38 | 7.76,139.69 6.51,139.69 MOTOR_08.GND_1 | 21.34,121.11 21.34,120.57 20.62,119.86 6.51,119.86 | 7.4,61.07 9.19,62.85 9.19,83.58 7.4,85.37
  pour Bottom: 0.09,157.63 76.29,157.63 76.29,0.15 0.09,0.15
GND_MCU  (via drill 0.35)
  Top 0.152: 26.7,27.29 SW1.10 v26.76,29.36 | U$1.GND 49.04,51.59 47.07,51.59 v43.14,47.66 41.89,46.41 41.89,44.45 U1.15 41.71,44.27 41.71,43.73 41.35,43.37 39.92,43.37 29.38,32.83 | 29.38,32.83 29.38,27.47 SW1.9 29.38,27.29 29.38,28.16 v30.57,29.36 30.57,28.58 SW1.8 | U1.12 43.14,37.12 v43.14,30.69 43.14,30.15 44.39,28.9 44.39,27.47 SW1.3 44.57,27.47 47.07,27.47 SW1.2 47.25,27.47 49.57,27.47 SW1.1 49.75,27.29 | v41.89,29.26 41.89,27.47 SW1.4 | SW1.8 31.88,27.47 34.21,27.47 SW1.7 v34.38,29.36 | 39.57,27.29 39.54,27.29 | 39.54,27.29 SW1.5 | 31.71,27.29 SW1.8 | 41.89,130.76 OUTPUT_POWER.GND_02 | 43.32,115.75 C2.1 43.5,115.57 43.5,115.03 | 43.32,119.5 C3.2 43.5,119.68 47.61,123.79 | 48.14,110.39 CONN02.12 | 36.53,110.21 CONN01.12 36.53,110.39 v36.53,111.46 | v41.18,68.21 41.35,68.39 41.35,69.46 U$1.GND2 | v36.53,115.75 34.74,117.53 TCAN1042.2 | v39.03,87.87 40.1,86.8 40.1,86.08 U$1.GND1 | 49.93,151.13 CAN_LED.2 | 31.42,27.73 SW1.8 | 29.38,32.83 30.78,32.83 R1.1 R1.2 | v36.92,29.36 SW1.6 36.89,27.29 36.89,20.86 35.99,19.96 35.99,17.1 36.09,17.21 40.14,17.21 40.31,17.37 40.31,20.04 40.14,20.21 39.98,20.21 39.54,20.65 39.54,27.29
  Bottom 0.152: v41.89,29.26 43.14,30.51 v43.14,30.69 v43.14,47.66 43.14,56.06 40.82,58.38 40.82,59.81 J1.3 40.82,59.99 41.18,60.35 v41.18,68.21 41.18,68.75 39.03,70.89 v39.03,87.87 39.03,91.09 40.64,92.69 J2.3 40.64,92.87 40.64,95.2 36.53,99.31 v36.53,111.46 v36.53,115.75 | v26.76,29.36 v30.57,29.36 | v34.38,29.36 v36.92,29.36
  pour Top: 0.09,157.63 76.29,157.63 76.29,0.15 0.09,0.15
I2CM_0  (via drill 0.35)
  Top 0.152: v31.71,86.44 33.67,88.41 33.67,89.12 34.56,90.01 34.56,95.55 36.35,97.34 36.35,100.2 CONN01.1
  Bottom 0.152: v31.71,86.44 30.63,85.37 J3.9
I2CM_1  (via drill 0.35)
  Top 0.152: v27.77,84.12 27.42,84.47 27.42,95.38 32.24,100.2 CONN01.2
  Bottom 0.152: v27.77,84.12 29.2,84.12 30.45,82.87 J3.8
I2CM_2  (via drill 0.35)
  Top 0.152: v32.96,89.12 34.21,90.37 34.21,100.56 35.81,102.17 36.35,102.17 CONN01.3
  Bottom 0.152: v32.96,89.12 33.31,89.12 34.03,88.41 34.03,82.15 32.06,80.19 30.63,80.19 J3.7
I2CM_3  (via drill 0.35)
  Top 0.152: v29.56,100.2 31.53,102.17 32.24,102.17 CONN01.4
  Bottom 0.152: v29.56,100.2 29.56,94.66 23.66,88.76 19.2,88.76 19.02,88.58 19.02,86.98 19.73,86.26 24.02,86.26 27.24,83.05 27.24,79.47 29.02,77.68 30.45,77.68 J3.6
I2CM_4  (via drill 0.35)
  Top 0.152: v34.38,103.42 35.1,104.13 36.35,104.13 CONN01.5 | v25.09,97.34 25.09,92.34 25.19,92.24 | 25.27,92.16 25.19,92.24 | v25.49,70.95 24.54,71.9 24.54,72.85 25.49,73.81 25.49,91.91 25.18,92.22 25.19,92.24
  Bottom 0.152: v34.38,103.42 31.17,103.42 v25.09,97.34 | 28.67,72.5 30.45,72.5 J3.4 28.67,72.54 27.08,70.95 v25.49,70.95
I2CM_5  (via drill 0.35)
  Top 0.152: v28.85,97.88 28.85,101.45 31.53,104.13 32.24,104.13 CONN01.6 | v25.81,69.68 23.91,71.58 23.91,72.85 24.54,73.49 24.54,90.63 v24.56,90.73
  Bottom 0.152: v28.85,97.88 28.85,94.48 25.09,90.73 v24.56,90.73 | 30.45,70 J3.3 30.26,69.68 v25.81,69.68
I2CM_6  (via drill 0.35)
  Top 0.152: v34.38,105.38 35.28,106.28 36.35,106.28 CONN01.7 | v24.38,96.63 24.38,92.69 23.31,91.62 23.27,91.59 23.27,90.95 23.91,90.32 23.91,73.49 23.27,72.85 23.27,71.27 25.18,69.36 25.18,65.55 v25.45,65.53 v25.45,63.39 | 23.31,66.43 19.55,62.67 v19.55,59.81
  Bottom 0.152: v34.38,105.38 32.06,105.38 24.38,97.7 v24.38,96.63 | v19.55,59.81 19.02,60.35 19.02,61.78 19.55,62.32 24.38,62.32 v25.45,63.39 | v25.45,65.53 25.99,65.53 27.77,67.32 30.45,67.32 J3.2
I2CM_7  (via drill 0.35)
  Top 0.152: v27.77,98.05 27.77,102.52 31.53,106.28 32.24,106.28 CONN01.8 | v23.66,94.12 23.66,92.52 23,91.85 | 22.95,91.8 23,91.85 | 22.95,66.6 18.84,62.49 18.84,51.24 23.66,46.41 24.38,46.41 25.78,47.81 | v28.67,50.7 25.78,47.81 | 23,91.85 22.32,92.54 22,92.54 16.6,87.14 16.6,81.43 6.44,71.27 6.44,49.99 13.43,43.01 v23.91,43.01 | v25.81,44.91 25.81,47.77 25.78,47.81
  Bottom 0.152: v27.77,98.05 23.84,94.12 v23.66,94.12 | v28.67,50.7 28.67,63.03 30.45,64.82 J3.1 | v25.81,44.91 v23.91,43.01
I2CM_8  (via drill 0.35)
  Top 0.152: v34.38,109.31 35.28,108.42 36.35,108.42 CONN01.9 | 22.59,104.67 23.31,105.38 v25.09,105.38 24.86,105.24 24.86,104.6 15.97,95.71 15.97,81.43 5.81,71.27 5.81,49.99 15.65,40.15 v27.08,40.15 | 22.59,66.78 18.48,62.67 18.48,51.06 27.6,41.94 v28.13,41.94
  Bottom 0.152: v34.38,109.31 29.02,109.31 v25.09,105.38 | 29.3,40.78 41.53,28.54 42.25,28.54 48.32,34.62 48.32,64.82 J4.1 | 29.3,40.78 v28.13,41.94 | v27.08,40.15 27.72,40.79 29.3,40.79 29.3,40.78
I2CM_9  (via drill 0.35)
  Top 0.152: v40.1,108.24 39.21,107.35 34.74,107.35 33.85,108.24 32.42,108.24 CONN01.10 | v43.32,96.8 45.29,94.84 45.29,89.83 44.03,88.58 44.03,80.72 45.11,79.65 45.11,69.11 v44.93,68.93
  Bottom 0.152: v40.1,108.24 43.32,105.02 v43.32,96.8 | v44.93,68.93 46.89,68.93 48.32,67.5 J4.2
I2CM_10  (via drill 0.35)
  Top 0.152: v45.46,81.26 46.18,81.97 46.18,84.83 48.14,86.8 48.14,100.2 CONN02.1
  Bottom 0.152: v45.46,81.26 39.92,75.72 39.92,73.04 42.96,70 48.32,70 J4.3
I2CM_11  (via drill 0.35)
  Top 0.152: v44.03,99.13 44.03,100.2 CONN02.2
  Bottom 0.152: v44.03,99.13 52.79,90.37 52.79,75.54 49.93,72.68 48.5,72.68 J4.4
I2CM_12  (via drill 0.35)
  Top 0.152: v51.9,81.08 51.9,100.2 49.93,102.17 48.32,102.17 CONN02.3
  Bottom 0.152: v51.9,81.08 51.9,79.65 49.93,77.68 48.5,77.68 J4.6
I2CM_13  (via drill 0.35)
  Top 0.152: v45.11,96.45 41.89,99.66 41.89,100.91 43.14,102.17 43.86,102.17 CONN02.4
  Bottom 0.152: v45.11,96.45 46.18,96.45 51.72,90.91 51.72,82.15 49.75,80.19 48.5,80.19 J4.7
I2CM_15  (via drill 0.35)
  Top 0.152: v44.57,94.48 41.53,97.52 41.53,102.52 43.14,104.13 43.86,104.13 CONN02.6
  Bottom 0.152: v44.57,94.48 44.57,87.51 46.72,85.37 48.32,85.37 J4.9
MA1_01  (via drill 0.35)
  Top 0.152: v8.67,14.12 21.37,26.82 21.37,37.61 22.64,38.88 22.95,38.88 CM_01.1
  Bottom 0.152: v8.67,14.12 7.4,12.85 MOTOR_01.A1
MA1_02  (via drill 0.35)
  Top 0.152: v56.93,14.12 61.05,18.24 61.05,37.29 62.64,38.88 CM_02.1
  Bottom 0.152: v56.93,14.12 55.66,12.85 MOTOR_02.A1
MA1_03  (via drill 0.35)
  Top 0.152: v61.37,65.87 56.61,70.63 56.61,78.89 57.88,80.16 60.74,80.16 62.64,78.25 CM_03.1 | v62.64,63.96 62.64,63.33 v61.37,62.06 | v55.34,59.84 52.16,59.84 51.53,60.47 v51.21,60.47 | v51.21,52.85 53.43,52.85 v54.07,52.22
  Bottom 0.152: v61.37,65.87 62.64,64.6 v62.64,63.96 | v61.37,62.06 59.78,60.47 59.47,60.47 58.51,59.52 55.66,59.52 v55.34,59.84 | v51.21,52.85 v51.21,60.47 | v54.07,52.22 54.07,50.95 MOTOR_03.A1
MA1_04  (via drill 0.35)
  Top 0.152: v7.76,49.63 17.29,59.16 | 17.29,59.16 17.41,59.28 17.41,70.71 17.47,70.85 | v22.95,79.84 CM_04.1 | v19.78,69.05 19.78,65.23 17.24,62.7 17.24,59.2 17.29,59.16
  Bottom 0.152: v7.76,49.63 6.51,50.88 MOTOR_04.A1 | v22.95,79.84 22.95,72.22 v19.78,69.05
MA1_05  (via drill 0.35)
  Top 0.152: v63.59,100.48 63.59,113.18 62.96,113.81 CM_05.1
  Bottom 0.152: v63.59,100.48 60.74,97.62 60.74,90.32 MOTOR_05.A1
MA1_06  (via drill 0.35)
  Top 0.152: v8.67,91.59 8.67,94.44 21.37,107.14 21.37,112.54 22.64,113.81 22.95,113.81 CM_06.1
  Bottom 0.152: v8.67,91.59 7.4,90.32 MOTOR_06.A1
MA1_07  (via drill 0.35)
  Top 0.152: v58.2,130.96 61.05,133.81 61.05,152.87 62.64,154.45 CM_07.1
  Bottom 0.152: v58.2,130.96 56.93,129.69 MOTOR_07.A1
MA1_08  (via drill 0.35)
  Top 0.152: v8.67,130.96 21.37,143.66 21.37,153.18 22.64,154.45 22.95,154.45 CM_08.1
  Bottom 0.152: v8.67,130.96 7.4,129.69 MOTOR_08.A1
MA2_01  (via drill 0.35)
  Top 0.152: CM_01.2 20.41,28.4 v8.67,16.66
  Bottom 0.152: v8.67,16.66 7.4,15.39 MOTOR_01.A2
MA2_02  (via drill 0.35)
  Top 0.152: v56.93,16.66 60.1,19.83 60.1,35.07 CM_02.2
  Bottom 0.152: v56.93,16.66 55.66,15.39 MOTOR_02.A2
MA2_03  (via drill 0.35)
  Top 0.152: v60.42,67.77 60.42,74.44 CM_03.2 | v63.59,64.6 63.59,62.38 v66.13,59.84 | v62.64,54.12 v66.13,57.61 | v60.74,53.17 59.78,53.17 v59.15,53.8
  Bottom 0.152: v63.59,64.6 v60.42,67.77 | v66.13,57.61 v66.13,59.84 | v62.64,54.12 61.69,53.17 v60.74,53.17 | v59.15,53.8 58.83,53.49 MOTOR_03.A2
MA2_04  (via drill 0.35)
  Top 0.152: v8.35,54.76 16.92,63.33 16.92,70.95 20.41,74.44 CM_04.2
  Bottom 0.152: v8.35,54.76 8.35,53.49 MOTOR_04.A2
MA2_05  (via drill 0.35)
  Top 0.152: v62.64,101.43 62.64,102.38 60.42,104.6 60.42,110 CM_05.2
  Bottom 0.152: v62.64,101.43 60.1,98.89 60.1,92.86 MOTOR_05.A2
MA2_06  (via drill 0.35)
  Top 0.152: CM_06.2 20.41,106.83 v7.71,94.13
  Bottom 0.152: v7.71,94.13 7.71,92.86 MOTOR_06.A2
MA2_07  (via drill 0.35)
  Top 0.152: v60.1,133.81 60.1,150.64 CM_07.2
  Bottom 0.152: v60.1,133.81 58.51,132.23 MOTOR_07.A2
MA2_08  (via drill 0.35)
  Top 0.152: CM_08.2 20.41,145.25 v8.67,133.5
  Bottom 0.152: v8.67,133.5 7.4,132.23 MOTOR_08.A2
MB1_01  (via drill 0.35)
  Top 0.152: CM_01.4 15.33,29.36 v7.71,21.74
  Bottom 0.152: v7.71,21.74 7.71,20.47 MOTOR_01.B1
MB1_02  (via drill 0.35)
  Top 0.152: v55.02,21.74 55.02,35.07 CM_02.4
  Bottom 0.152: v55.02,21.74 55.02,20.47 MOTOR_02.B1
MB1_03  (via drill 0.35)
  Top 0.152: v59.47,59.52 57.56,61.42 57.56,69.05 55.34,71.27 55.34,74.44 CM_03.4
  Bottom 0.152: v59.47,59.52 58.51,58.57 MOTOR_03.B1
MB1_04  (via drill 0.35)
  Top 0.152: CM_04.4 15.33,67.77 v7.4,59.84
  Bottom 0.152: v7.4,59.84 7.4,58.57 MOTOR_04.B1
MB1_05  (via drill 0.35)
  Top 0.152: v61.69,102.38 55.34,108.73 55.34,110 CM_05.4
  Bottom 0.152: v61.69,102.38 61.69,101.11 58.51,97.94 MOTOR_05.B1
MB1_06  (via drill 0.35)
  Top 0.152: v4.54,99.21 15.33,110 CM_06.4
  Bottom 0.152: v4.54,99.21 4.54,97.94 MOTOR_06.B1
MB1_07  (via drill 0.35)
  Top 0.152: v55.02,138.58 55.02,150.64 CM_07.4
  Bottom 0.152: v55.02,138.58 55.02,137.31 MOTOR_07.B1
MB1_08  (via drill 0.35)
  Top 0.152: CM_08.4 15.33,145.25 v8.67,138.58
  Bottom 0.152: v8.67,138.58 7.4,137.31 MOTOR_08.B1
MB2_01  (via drill 0.35)
  Top 0.152: v8.67,19.2 16.29,26.82 16.29,37.61 17.56,38.88 17.87,38.88 CM_01.3
  Bottom 0.152: v8.67,19.2 7.4,17.93 MOTOR_01.B2
MB2_02  (via drill 0.35)
  Top 0.152: v56.61,19.2 56.61,37.93 57.56,38.88 CM_02.3
  Bottom 0.152: v56.61,19.2 56.61,17.93 MOTOR_02.B2
MB2_03  (via drill 0.35)
  Top 0.152: v69.31,73.17 62.32,73.17 61.69,73.81 61.69,78.57 60.74,79.52 59.78,79.52 58.51,78.25 57.88,78.25 CM_03.3 | v65.82,48.41 65.82,49.04 60.42,54.44 59.78,54.44 v59.15,55.07
  Bottom 0.152: v69.31,73.17 70.26,72.22 71.85,72.22 74.71,69.36 74.71,43.64 68.36,43.64 66.13,45.87 66.13,48.41 v65.82,48.41 | v59.15,55.07 58.2,56.03 MOTOR_03.B2
MB2_04  (via drill 0.35)
  Top 0.152: v8.35,57.3 16.29,65.23 16.29,76.98 17.56,78.25 17.87,78.25 CM_04.3
  Bottom 0.152: v8.35,57.3 8.35,56.03 MOTOR_04.B2
MB2_05  (via drill 0.35)
  Top 0.152: v59.15,94.76 60.1,93.81 68.67,93.81 69.31,94.44 69.31,109.05 63.28,115.08 59.78,115.08 58.51,113.81 57.88,113.81 CM_05.3
  Bottom 0.152: v59.15,94.76 58.51,95.4 MOTOR_05.B2
MB2_06  (via drill 0.35)
  Top 0.152: v8.67,96.67 16.29,104.29 16.29,112.54 17.56,113.81 17.87,113.81 CM_06.3
  Bottom 0.152: v8.67,96.67 7.4,95.4 MOTOR_06.B2
MB2_07  (via drill 0.35)
  Top 0.152: v56.61,136.04 56.61,153.5 57.56,154.45 CM_07.3
  Bottom 0.152: v56.61,136.04 56.61,134.77 MOTOR_07.B2
MB2_08  (via drill 0.35)
  Top 0.152: v8.67,136.04 16.29,143.66 16.29,153.18 17.56,154.45 17.87,154.45 CM_08.3
  Bottom 0.152: v8.67,136.04 7.4,134.77 MOTOR_08.B2
MDIR_01  (via drill 0.35)
  Top 0.152: v51.54,6.02 51.54,36.94 v58.69,44.09 | v55.83,68.75 51.54,73.04 46.89,73.04 46.54,72.68 46.54,71.43 48.32,69.64 49.04,69.64 U$1.6
  Bottom 0.152: v51.54,6.02 37.42,6.02 35.81,7.63 21.7,7.63 MOTOR_01.DIR | v58.69,44.09 58.69,46.59 57.79,47.48 53.51,47.48 53.33,47.66 53.33,49.09 54.22,49.98 58.33,49.98 59.05,50.7 59.05,52.67 62.62,56.24 62.62,61.96 v55.83,68.75
MDIR_02  (via drill 0.35)
  Top 0.152: v61.37,50.34 64.23,47.48 64.23,47.46 64.23,46.5 68.67,42.06 68.67,21.42 67.72,20.47 v67.72,9.04 | v56.9,68.75 51.18,74.47 49.22,74.47 U$1.8
  Bottom 0.152: 69.05,7.81 69.77,7.81 MOTOR_02.DIR 68.99,7.77 v67.72,9.04 | v61.37,50.34 64.05,53.02 64.05,61.6 v56.9,68.75
MDIR_03  (via drill 0.35)
  Top 0.152: v67.8,58.92 67.8,59.81 69.05,61.07 69.05,68.09 | 69.05,68.93 69.05,68.09 | 51.72,77.86 49.93,79.65 49.22,79.65 U$1.10 49.31,79.84 51.85,79.84 52.8,80.79 52.8,101.11 52.48,101.43 v52.48,108.41 | v52.48,110 52.48,112.86 55.34,115.72 63.59,115.72 v69.31,110 | v72.17,70.63 v72.17,107.14 | v69.63,68.73 68.99,68.09 69.05,68.09
  Bottom 0.152: v67.8,58.92 67.8,48.38 70.3,45.88 71.2,45.88 MOTOR_03.DIR | v52.48,110 v52.48,108.41 | v72.17,107.14 v69.31,110 | v72.17,70.63 70.26,68.73 v69.63,68.73
MDIR_04  (via drill 0.35)
  Top 0.152: v28.13,94.84 29.92,93.05 29.92,86.62 29.02,85.72 29.02,81.44 30.63,79.83 31.35,79.83 U$1.15/A1 | 23.84,91.09 v24.56,91.8 | 23.84,47.3 v24.02,47.13 23.91,47.14 23.91,60.79 23.59,61.11 23.59,64.6 23.91,64.92 23.91,70 22,71.9 v22,91.59
  Bottom 0.152: v28.13,94.84 27.6,94.84 v24.56,91.8 24.54,91.59 v22,91.59 | v24.02,47.13 22.95,47.13 21.7,45.88 MOTOR_04.DIR
MDIR_05  (via drill 0.35)
  Top 0.152: v40.82,70.71 34.74,70.71 34.03,71.43 34.03,72.5 32.06,74.47 31.53,74.47 U$1.17/A3 | v47.61,63.21 52.97,63.21 60.12,56.06 63.51,56.06 68.34,60.89 v68.34,68.57
  Bottom 0.152: v40.82,70.71 44.93,66.6 44.93,64.28 46,63.21 v47.61,63.21 | v68.34,68.57 68.34,82.33 71.2,85.19 MOTOR_05.DIR
MDIR_06  (via drill 0.35)
  Top 0.152: v28.13,66.07 29.74,64.46 31.35,64.46 U$1.21/A7
  Bottom 0.152: v28.13,66.07 27.06,66.07 24.38,63.39 24.38,62.85 24.2,62.67 19.2,62.67 19.02,62.85 19.02,82.69 21.52,85.19 MOTOR_06.DIR
MDIR_07  (via drill 0.35)
  Top 0.152: 51.9,57.67 51.85,57.67 | 51.85,57.67 35.1,57.67 33.49,59.28 31.53,59.28 U$1.23/A9 | v70.12,123.25 70.12,69.34 | v54.7,54.76 51.85,57.61 51.85,57.67 | v56.93,57.3 v56.93,54.76 | v60.42,58.89 60.42,62.7 65.5,67.77 66.45,67.77 v69.63,70.95 | v71.21,71.27 71.21,123.02 v71.53,123.34
  Bottom 0.152: v70.12,123.25 71.38,124.5 MOTOR_07.DIR 71.21,124.29 71.53,124.29 v71.53,123.34 | v56.93,54.76 v54.7,54.76 | v56.93,57.3 57.24,57.61 58.83,57.61 60.1,58.89 v60.42,58.89 | v69.63,70.95 69.94,71.27 v71.21,71.27
MDIR_08  (via drill 0.35)
  Top 0.152: v38.32,75.9 39.57,74.65 41.35,74.65 U$1.25
  Bottom 0.152: v38.32,75.9 38.32,87.87 36.89,89.3 36.89,98.41 35.1,100.2 35.1,105.74 34.74,106.1 32.06,106.1 25.09,99.13 19.55,99.13 19.02,99.66 19.02,117.71 21.7,120.39 21.7,124.5 MOTOR_08.DIR
MENABLE  (via drill 0.35)
  Top 0.152: v34.21,73.39 35.46,72.14 36.35,72.14 U$1.33 | v24.56,101.09 24.56,100.74 24.02,100.2 24.02,99.48 25.53,97.97 | 25.81,97.7 25.53,97.97 | v25.45,72.14 25.81,72.5 25.81,72.54 25.81,73.49 26.13,73.81 26.13,97.3 25.49,97.94 25.53,97.97 | v73.88,29.61 v73.88,62.32 74.95,63.39 74.95,100.91 v74.23,101.63 74.23,136.83 71.38,139.69 v71.38,141.12 | v22.41,141.12 v22.41,123.25
  Bottom 0.152: v34.21,73.39 26.7,73.39 v25.45,72.14 23.66,70.36 23.66,68.39 | 23.66,68.39 23.66,64.64 22.77,63.74 21.7,63.74 MOTOR_04.ENA | 23.66,68.39 33.67,68.39 34.03,68.03 34.03,64.46 33.67,64.1 31.71,64.1 30.99,63.39 30.99,51.24 21.7,41.94 21.7,25.68 MOTOR_01.ENA | 22.41,102.88 22.77,102.88 v24.56,101.09 | 22.41,102.88 21.7,102.88 MOTOR_06.ENA 22.41,102.88 | 22.41,142.55 38.49,142.55 39.39,143.45 70.3,143.45 71.2,142.55 MOTOR_07.ENA 71.38,142.37 v71.38,141.12 | 22.41,142.55 21.7,142.55 MOTOR_08.ENA 22.41,142.55 | v73.88,29.61 69.95,25.68 MOTOR_02.ENA | v73.88,62.32 72.63,62.32 71.38,63.57 MOTOR_03.ENA | v74.23,101.63 72.98,102.88 71.38,102.88 MOTOR_05.ENA | v22.41,123.25 22.41,102.88 | 22.41,142.55 v22.41,141.12
MMS1  (via drill 0.35)
  Top 0.152: v24.74,99.84 24.74,99.31 26.17,97.88 | v24.56,61.24 26.17,62.85 | v50.47,100.56 51.54,99.48 51.54,84.12 49.75,82.33 49.22,82.33 U$1.11 | v69.95,24.25 69.95,57.13 71.2,58.38 v71.2,59.81 71.2,60.71 74.23,63.74 v74.23,100.56 73.52,101.27 73.52,126.83 71.38,128.97 71.38,129.15 | 71.38,129.15 v71.38,138.62 | v52.43,116.28 57.62,116.28 70.48,129.15 71.38,129.15 | v21.68,21.74 21.68,20.78 25.81,16.66 29.94,16.66 30.26,16.97 35.34,16.97 46.45,5.86 50.58,5.86 51.21,5.23 51.85,5.23 67.72,21.1 v67.72,21.74
  Bottom 0.152: 23.49,60.17 22.59,61.07 21.7,61.07 MOTOR_04.MS1 | 23.49,60.17 24.74,58.92 24.74,45.52 19.02,39.8 19.02,24.79 20.62,23.18 21.52,23.18 MOTOR_01.MS1 v21.68,21.74 | 23.49,60.17 v24.56,61.24 | MOTOR_06.MS1 21.7,100.38 24.2,100.38 v24.74,99.84 31.35,106.45 32.6,106.45 35.1,108.96 35.1,115.39 36.17,116.46 36.89,116.46 44.75,108.6 | v50.47,100.56 50.47,102.88 44.75,108.6 | v69.95,24.25 69.95,23.18 MOTOR_02.MS1 68.99,23.01 v67.72,21.74 | v71.2,59.81 71.2,61.07 MOTOR_03.MS1 | v74.23,100.56 71.38,100.56 MOTOR_05.MS1 | v71.38,138.62 71.38,139.69 MOTOR_07.MS1 | v52.43,116.28 44.75,108.6
MMS2  (via drill 0.35)
  Top 0.152: 47.07,75.9 46.54,76.43 46.54,82.87 48.32,84.65 49.04,84.65 U$1.12 49.31,84.92 v49.31,98.25 | v67.62,61.78 65.3,64.1 | v71.2,21.75 v71.2,57.31 | v51.53,110.64 51.53,118.57 v68.99,136.04
  Bottom 0.152: 20.27,58.03 20.8,58.56 21.52,58.56 MOTOR_04.MS2 20.27,58.03 | 20.27,58.03 18.66,56.42 18.66,22.64 20.8,20.5 21.52,20.5 MOTOR_01.MS2 21.7,20.32 23.66,20.32 37.24,6.74 57.08,6.74 66.02,15.67 66.02,17.46 68.87,20.32 69.77,20.32 MOTOR_02.MS2 69.95,20.5 v71.2,21.75 | 20.27,58.03 18.66,59.64 18.66,95.73 20.8,97.88 21.52,97.88 MOTOR_06.MS2 | v71.2,57.31 71.2,58.56 MOTOR_03.MS2 71.2,58.74 70.12,58.74 67.62,61.24 v67.62,61.78 67.62,95.2 70.3,97.88 71.2,97.88 MOTOR_05.MS2 71.38,98.05 72.81,98.05 75.13,100.38 75.13,134.33 72.27,137.19 71.38,137.19 MOTOR_07.MS2 70.26,137.31 v68.99,136.04 | v49.31,98.25 51.53,100.48 v51.53,110.64
MSTEP_01  (via drill 0.35)
  Top 0.152: v30.28,16.03 v24.56,10.31 | v52.08,64.82 49.93,66.96 49.22,66.96 U$1.5
  Bottom 0.152: v24.56,10.31 21.7,10.31 MOTOR_01.STEP | v30.28,16.03 52.08,37.83 v52.08,64.82
MSTEP_02  (via drill 0.35)
  Top 0.152: v60.12,55.35 67.44,48.02 v67.44,46.23 | v60.12,57.13 60.12,57.85 53.68,64.28 53.68,68.21 49.93,71.96 49.22,71.96 U$1.7 | v69.77,11.57 69.77,23.36 69.05,24.07 v69.05,44.62
  Bottom 0.152: v60.12,57.13 v60.12,55.35 | 69.94,9.29 MOTOR_02.STEP 69.77,10.31 v69.77,11.57 | v67.44,46.23 v69.05,44.62
MSTEP_03  (via drill 0.35)
  Top 0.152: 49.22,76.97 U$1.9 49.31,76.98 50.26,76.98 v54.07,73.17 | v56.61,66.82 v54.07,69.36 | v58.51,64.92 62.01,64.92 65.82,68.73 v66.02,68.75
  Bottom 0.152: v66.02,68.75 66.02,62.32 68.52,59.81 68.52,50.16 70.12,48.56 71.2,48.56 MOTOR_03.STEP | v54.07,69.36 v54.07,73.17 | v58.51,64.92 v56.61,66.82
MSTEP_04  (via drill 0.35)
  Top 0.152: v34.56,88.94 34.21,88.58 34.21,84.47 32.06,82.33 31.53,82.33 U$1.14/A0 | v22.95,49.63 v22.95,65
  Bottom 0.152: v34.56,88.94 34.56,77.68 32.78,75.9 27.42,75.9 22.95,71.43 v22.95,65 | v22.95,49.63 21.7,48.38 MOTOR_04.STEP
MSTEP_05  (via drill 0.35)
  Top 0.152: v68.34,94.66 53.86,109.13 42.07,109.13 39.75,106.81 39.75,100.2 36.17,96.63 36.17,83.76 35.81,83.4 34.56,83.4 34.03,82.87 34.03,79.29 31.88,77.15 31.53,77.15 U$1.16/A2
  Bottom 0.152: v68.34,94.66 68.34,89.83 70.3,87.87 71.2,87.87 MOTOR_05.STEP
MSTEP_06  (via drill 0.35)
  Top 0.152: v36.17,65.71 34.56,65.71 33.31,66.96 31.53,66.96 U$1.20/A6
  Bottom 0.152: v36.17,65.71 36.17,89.3 36.53,89.66 36.53,95.91 36.17,96.27 31.71,96.27 23.31,87.87 21.7,87.87 MOTOR_06.STEP
MSTEP_07  (via drill 0.35)
  Top 0.152: v59.76,50.88 52.61,58.03 47.07,58.03 44.93,60.17 35.1,60.17 33.49,61.78 31.53,61.78 U$1.22/A8 | v60.83,51.95 66.73,46.05 66.73,45.88 67.09,45.52 67.8,45.52 69.59,47.3 69.59,57.31 70.48,58.21 70.48,122.54 70.84,122.89 v70.84,128.44
  Bottom 0.152: v60.83,51.95 v59.76,50.88 | v70.84,128.44 70.84,127.54 71.2,127.18 MOTOR_07.STEP
MSTEP_08  (via drill 0.35)
  Top 0.152: v44.03,71.07 43.14,71.96 41.53,71.96 U$1.24 | v54.04,107.88 v54.04,83.94
  Bottom 0.152: v44.03,71.07 50.83,71.07 54.04,74.29 v54.04,83.94 | v54.04,107.88 54.04,116.64 51.72,118.96 30.81,118.96 22.77,127 21.7,127 MOTOR_08.STEP
MUX_RESET
  Bottom 0.152: J1.2 43.14,59.99 43.14,67.32 39.39,71.07 39.39,87.16 43.14,90.91 43.14,92.69 J2.2
MUX_S2  (via drill 0.35)
  Top 0.152: v44.21,47.66 42.43,45.88 42.43,44.45 U1.14 | v44.21,66.25 44.21,70.18 44.75,70.71 44.75,79.47 42.07,82.15 41.53,82.15 U$1.28
  Bottom 0.152: v44.21,66.25 v44.21,47.66
MUX_S3  (via drill 0.35)
  Top 0.152: v44.93,46.23 43.14,44.45 U1.13 | v40.28,56.24 v44.93,51.59 | v36.89,75.9 36.89,76.61 36.53,76.97 U$1.31
  Bottom 0.152: v44.93,51.59 v44.93,46.23 | v40.28,56.24 39.92,56.6 39.92,63.03 40.28,63.39 40.28,66.96 36.89,70.36 v36.89,75.9
MUX_SCL  (via drill 0.35)
  Top 0.152: 29.92,68.93 27.42,66.43 27.42,65.35 29.74,63.03 v31.71,63.03 | 29.92,68.93 30.45,69.46 31.35,69.46 U$1.19/A5 | v29.2,88.94 29.2,86.44 28.49,85.72 28.49,72.32 27.95,71.79 27.95,70.89 29.92,68.93
  Bottom 0.152: v31.71,63.03 31.71,61.24 32.96,59.99 J1.6 | v29.2,88.94 32.96,92.69 J2.6
MUX_SDA  (via drill 0.35)
  Top 0.152: v28.67,71.43 29.2,71.96 31.35,71.96 U$1.18/A4
  Bottom 0.152: v28.67,71.43 33.13,71.43 33.31,71.25 | 33.31,71.25 35.46,69.11 35.46,60.17 35.64,59.99 J1.5 | 33.31,71.25 35.64,73.57 35.64,92.69 J2.5
MUX_SIG  (via drill 0.35)
  Top 0.152: v35.1,36.94 35.28,37.12 35.81,37.12 U1.1 | v34.74,68.21 35.28,68.21 36.35,67.14 U$1.A13
  Bottom 0.152: v35.1,36.94 35.1,38.19 32.42,40.87 32.42,55.17 34.74,57.49 v34.74,68.21
N$1
  Top 0.152: POWER_LED_RES.1 29.74,151.31 29.74,155.06 POWER_LED.1
N$193
  Top 0.152: CAN_LED.1 46.72,151.31 46.72,155.06 CAN_LED_R.1
NEO_PIXEL
  Top 0.152: CONN02.7 47.43,106.28 45.82,104.67 45.82,89.83 44.39,88.41 44.39,80.9 46.18,79.11 46.18,61.6 48.32,59.46 49.04,59.46 U$1.2
S_SCL
  Top 0.152: CONN02.10 43.86,108.24 42.96,108.24 40.1,105.38 40.1,100.02 36.53,96.45 36.53,82.33 U$1.29
S_SDA
  Top 0.152: CONN02.9 48.14,108.24 47.43,108.24 45.82,106.63 45.82,105.56 45.46,105.2 42.07,105.2 40.46,103.59 40.46,99.84 36.89,96.27 36.89,83.58 37.42,83.05 38.67,83.05 38.85,82.87 38.85,81.61 37.07,79.83 36.53,79.83 U$1.30
S_SEN_01  (via drill 0.35)
  Top 0.152: v41.53,105.74 42.07,106.28 43.86,106.28 CONN02.8 | v41.53,96.45 41.53,89.66 v42.25,88.94 | v40.1,81.08 39.57,80.54 39.39,80.54 38.85,80.01 38.85,79.11 38.14,78.4 v37.6,78.4 | v40.1,68.21 41.35,66.96 U$1.A12
  Bottom 0.152: v41.53,96.45 v41.53,105.74 | v42.25,88.94 42.25,83.22 v40.1,81.08 | v37.6,78.4 37.6,70.71 v40.1,68.21
VCC_IN  (via drill 0.35)
  Top 1.27: INPUT_POWER_2.VCC_01 30.57,138.26 v30.57,136.04 | INPUT_POWER_2.VCC_02 48.35,138.28 v48.35,136.04
  Bottom 1.27: v30.57,136.04 31.84,134.77 INPUT_POWER_1.VCC_02 33.11,129.69 45.81,129.69 INPUT_POWER_1.VCC_01 47.08,134.77 v48.35,136.04
VCC_M  (via drill 0.35)
  Top 1.016: 33,126.85 26.95,120.8 v20.41,120.8 | OUTPUT_POWER.VCC_01 33,126.85 | 33,126.85 33.41,126.85 v34.38,125.88 | 33.11,130.96 33,130.85 OUTPUT_POWER.VCC_01 | OUTPUT_POWER.VCC_01 28.03,135.63 28.03,149.63 POWER_LED_RES.2
  Bottom 0.152: MOTOR_03.VCC 56.01,48.38 56.9,48.38 57.24,48.41 | MOTOR_06.VCC 6.3,87.79 4.26,87.79 3.9,87.78
  Bottom 1.016: v20.41,120.8 16.6,120.8 10.25,127.15 MOTOR_08.VCC 1.6,125.88 1.6,120.43 M_C11.1 M_C9.1 1.59,111.91 1.58,89.05 | MOTOR_05.VCC 59.78,87.78 | 59.78,87.78 64.86,92.86 64.86,108.1 68.96,112.19 M_C8.1 M_C10.1 62.19,127.15 MOTOR_07.VCC 54.7,127.15 53.43,125.95 53.39,125.95 53.31,125.88 v34.38,125.88 | 59.78,87.78 64.86,82.7 64.86,52.22 61.05,48.41 | 61.05,48.41 57.24,48.41 | 61.05,48.41 71.08,38.38 M_C6.1 M_C5.1 64.86,28.22 64.86,17.93 57.24,10.31 MOTOR_02.VCC | MOTOR_01.VCC 3.9,10.31 1.53,12.68 1.54,30.82 3.77,33.17 M_C4.1 M_C7.1 2.82,39.52 1.55,40.79 1.55,47.14 | MOTOR_04.VCC 2.82,48.41 1.55,47.14 | 1.55,47.14 1.58,86.51 | 1.58,86.51 | 1.58,86.51 1.58,89.05 | 3.9,87.78 1.58,89.05
VCC_MCU
  Top 0.508: C3.1 40.6,121.94 45.7,127.04 45.81,130.55 OUTPUT_POWER.VCC_02 | C3.1 C2.2 | C2.2 43.27,113.05 43.27,110.64 43.62,110.29 CONN02.11 | C2.2 38.06,113.18 35.14,113.18 CONN01.11 30.22,110.29 26.76,106.83 26.76,54.76 29.79,51.73 U$1.VIN | C3.1 35.65,119.53 35.02,118.89 TCAN1042.3

### Text on the board
tPlace: OSC
bPlace: !INT | !RST | GND | 3V3 | SDA | SCL | GND | GND | GND | GND | 0 | 15 | 1 | 14 | 2 | 13 | 3 | 12 | VC1 | VC2 | 4 | 11 | 5 | 10 | 6 | 9 | 7 | 8 | !RST | GND | 3.3V | SDA | SCL
tNames: IN | 8 | 7 | IN | - | IN | - | MOTOR | MCU | 6 | 5 | 4 | 3 | 1 | 2 | OUT